# EasyEDA schematic SCH_New-Project_2025-11-07.json

## Sheets
1 Общая схема: TITLE: Abstract schema; REV: 1.0; Date: 2025-10-27; Sheet: 1/1; Drawn By: corlov; Company: Orlov
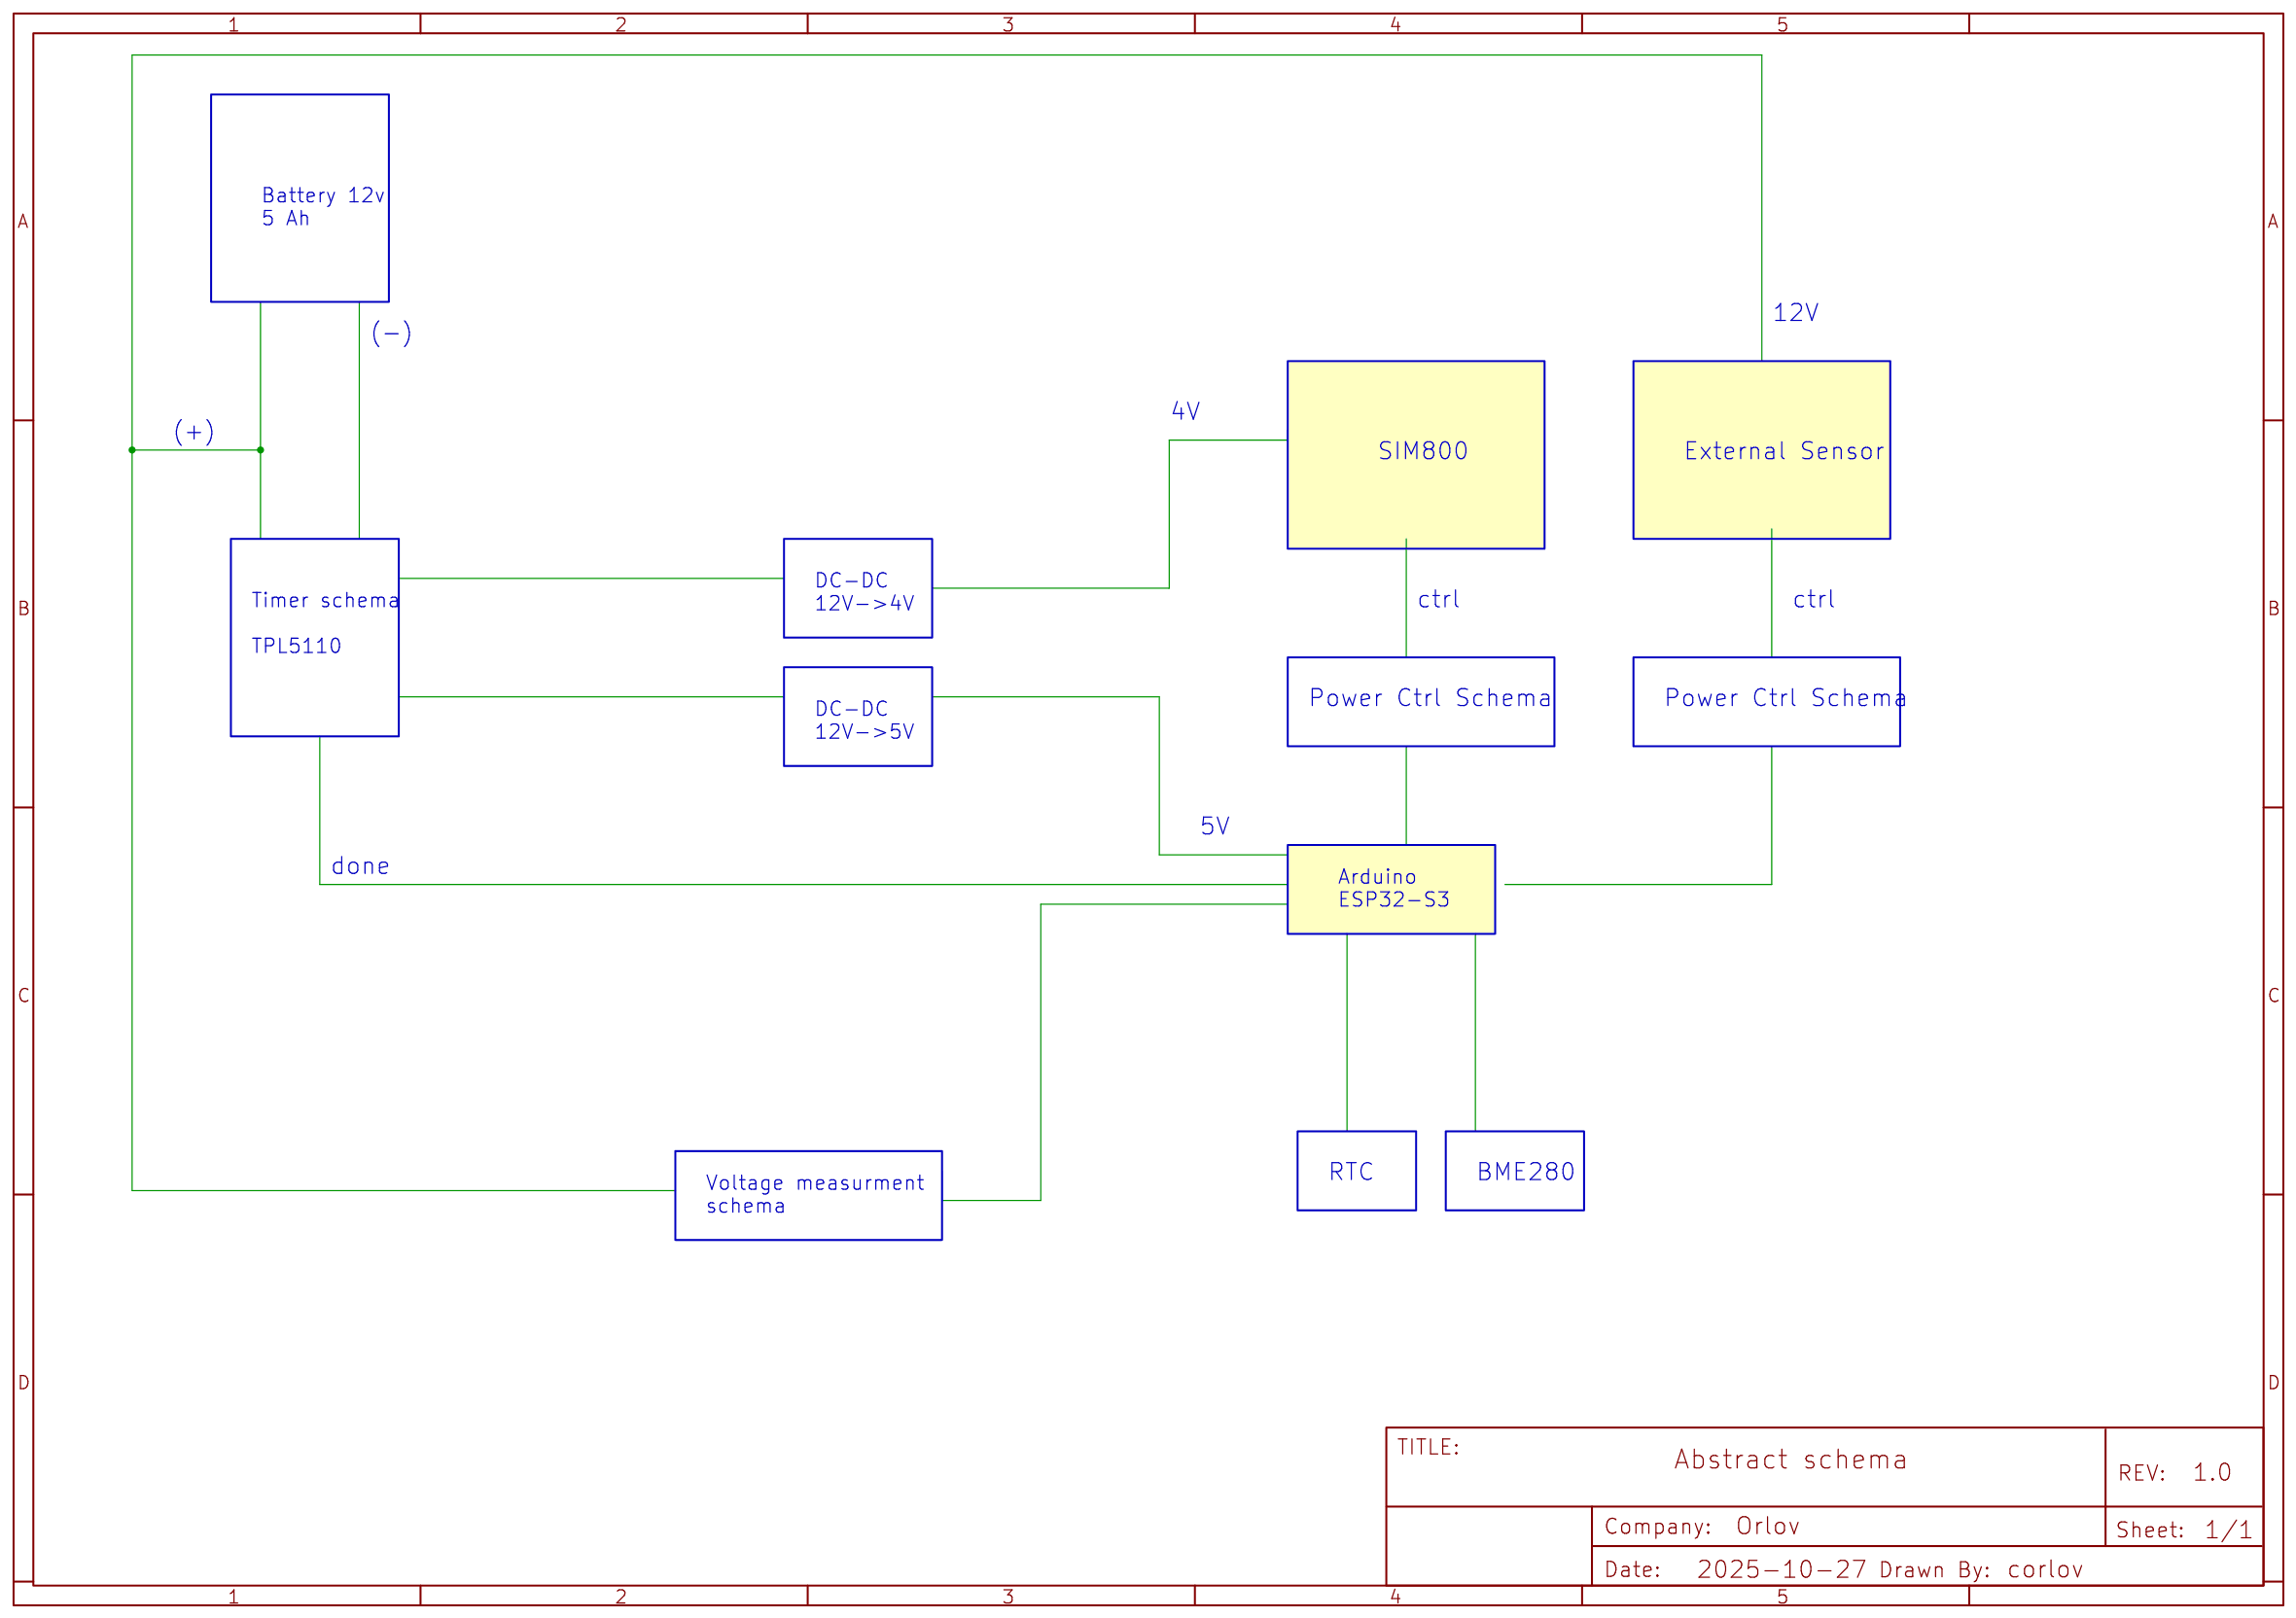
[diagram p0: Общая схема]
2 Питание по таймеру: TITLE: Timer TPL5110
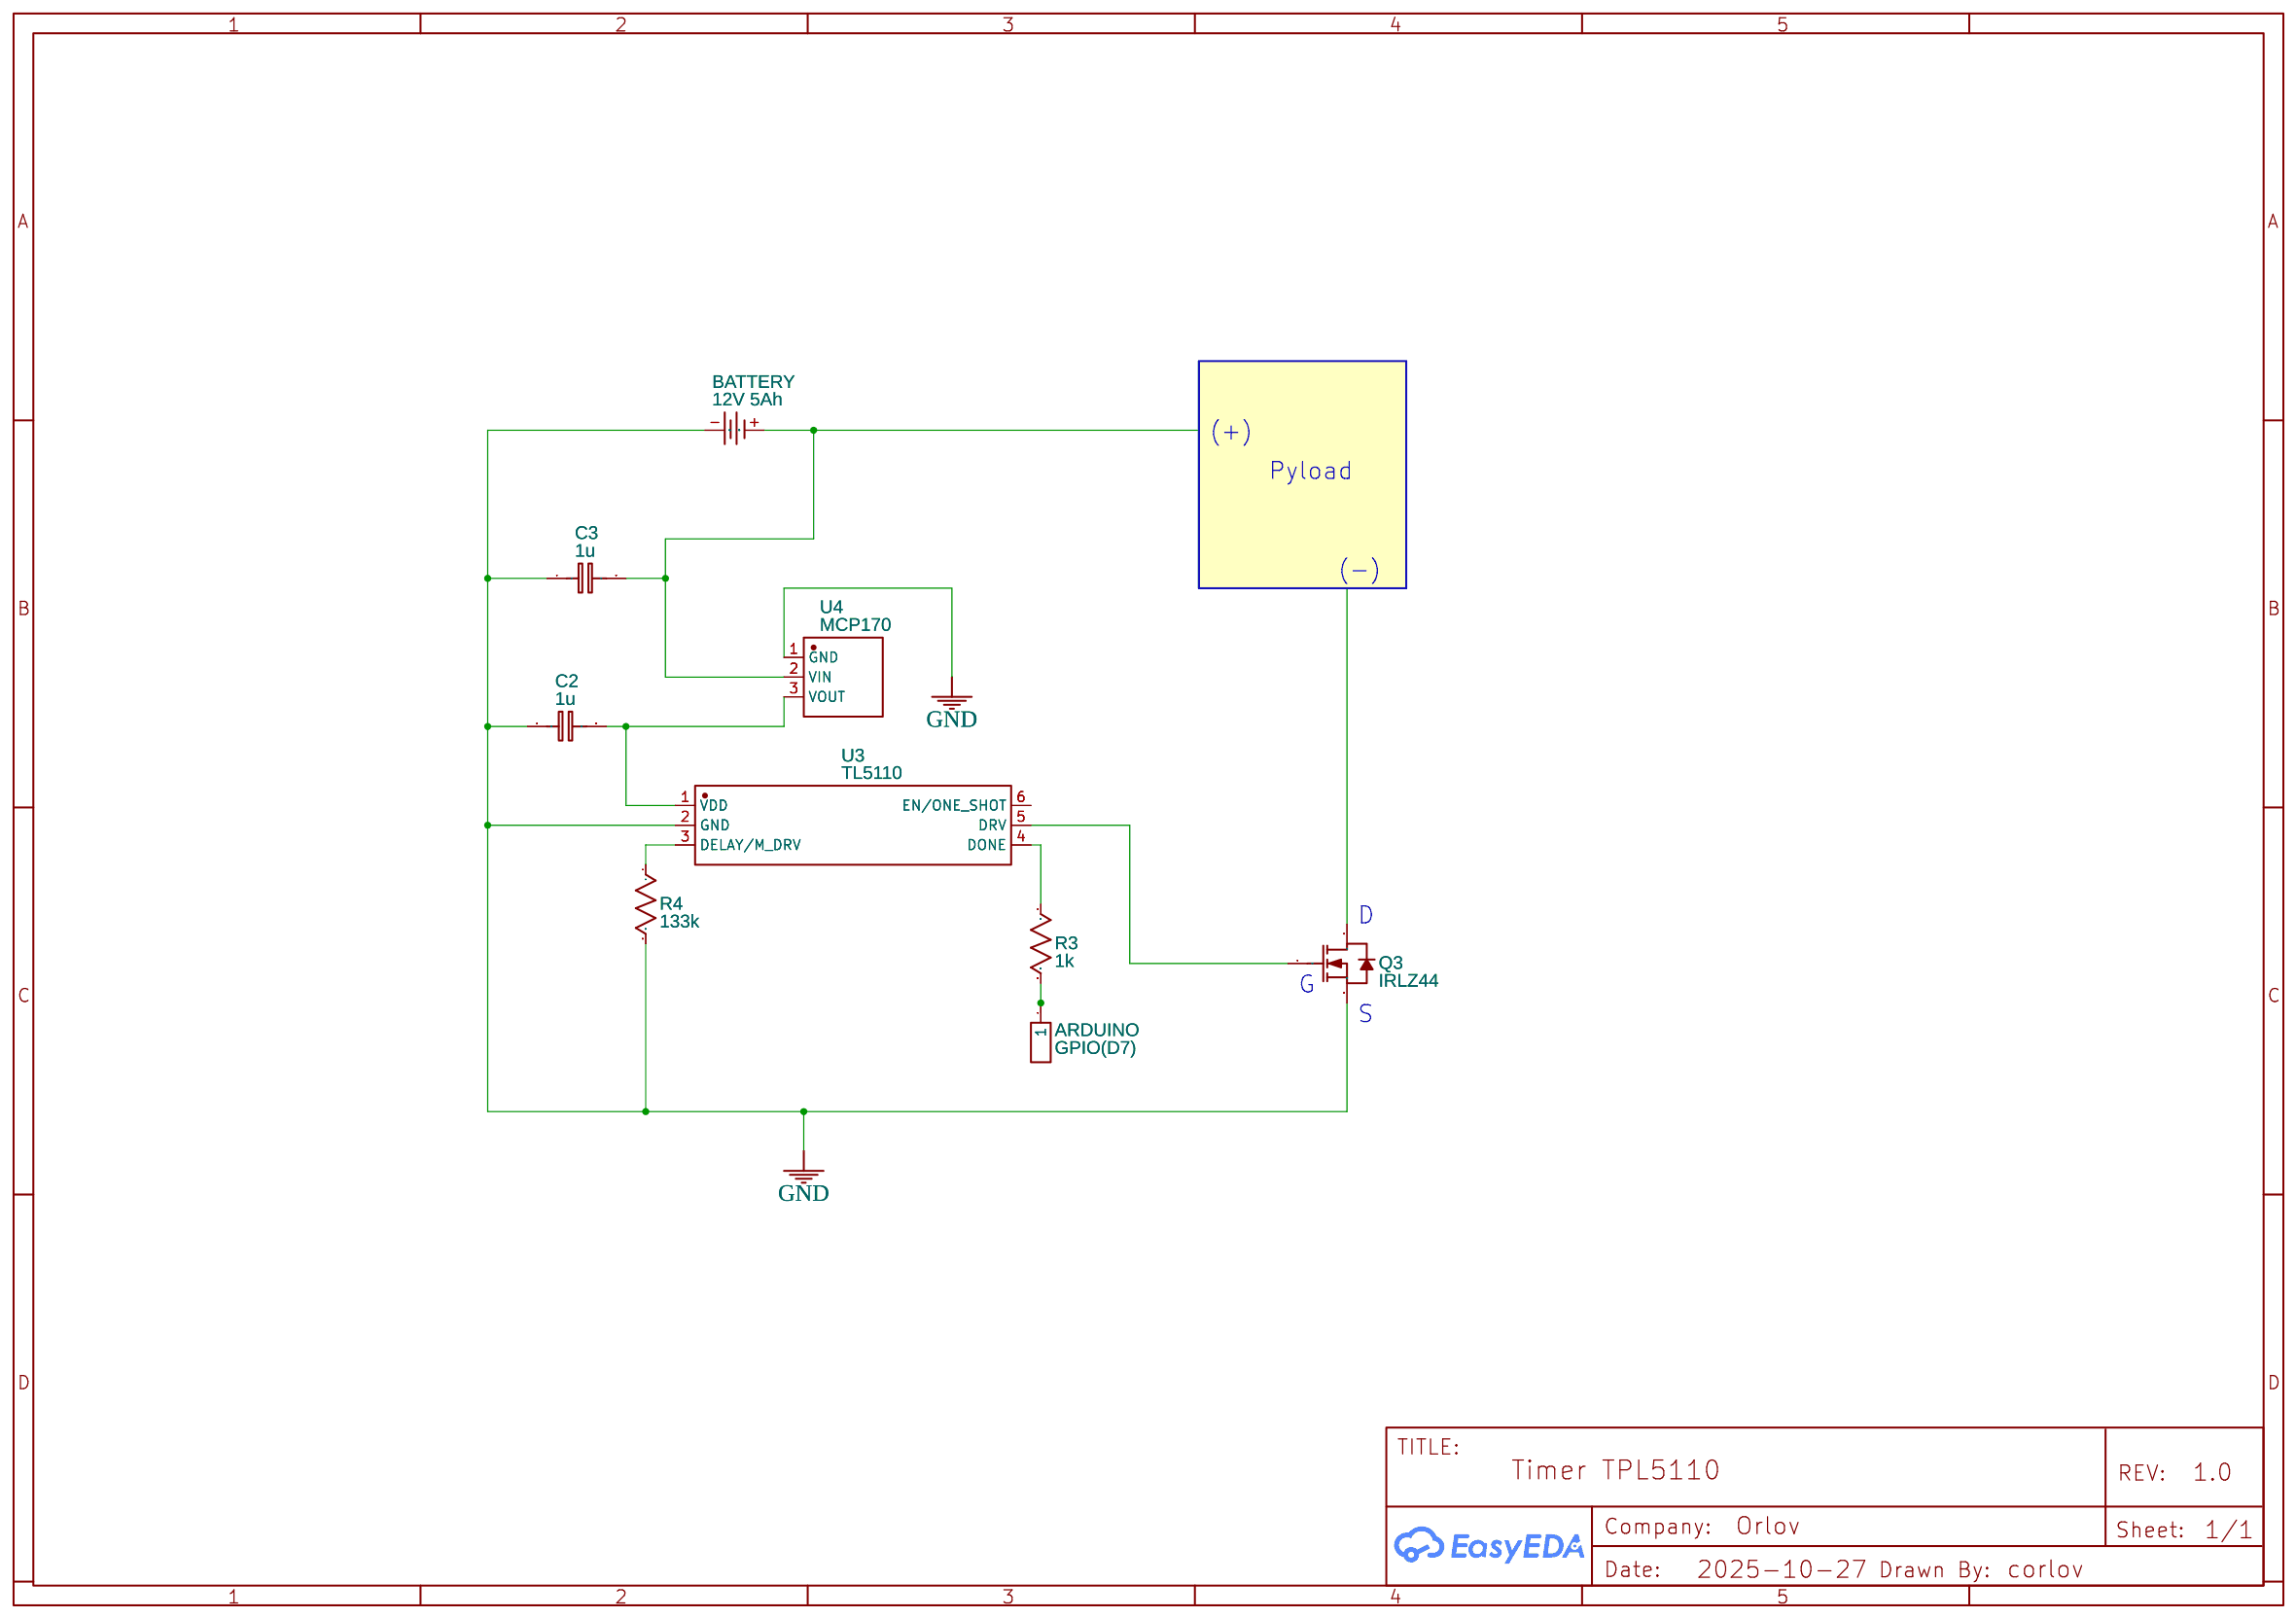
[diagram p1: Питание по таймеру]
3 PowerSwtich: TITLE: Power controol schema (sim/sensor); Date: 2025-10-26
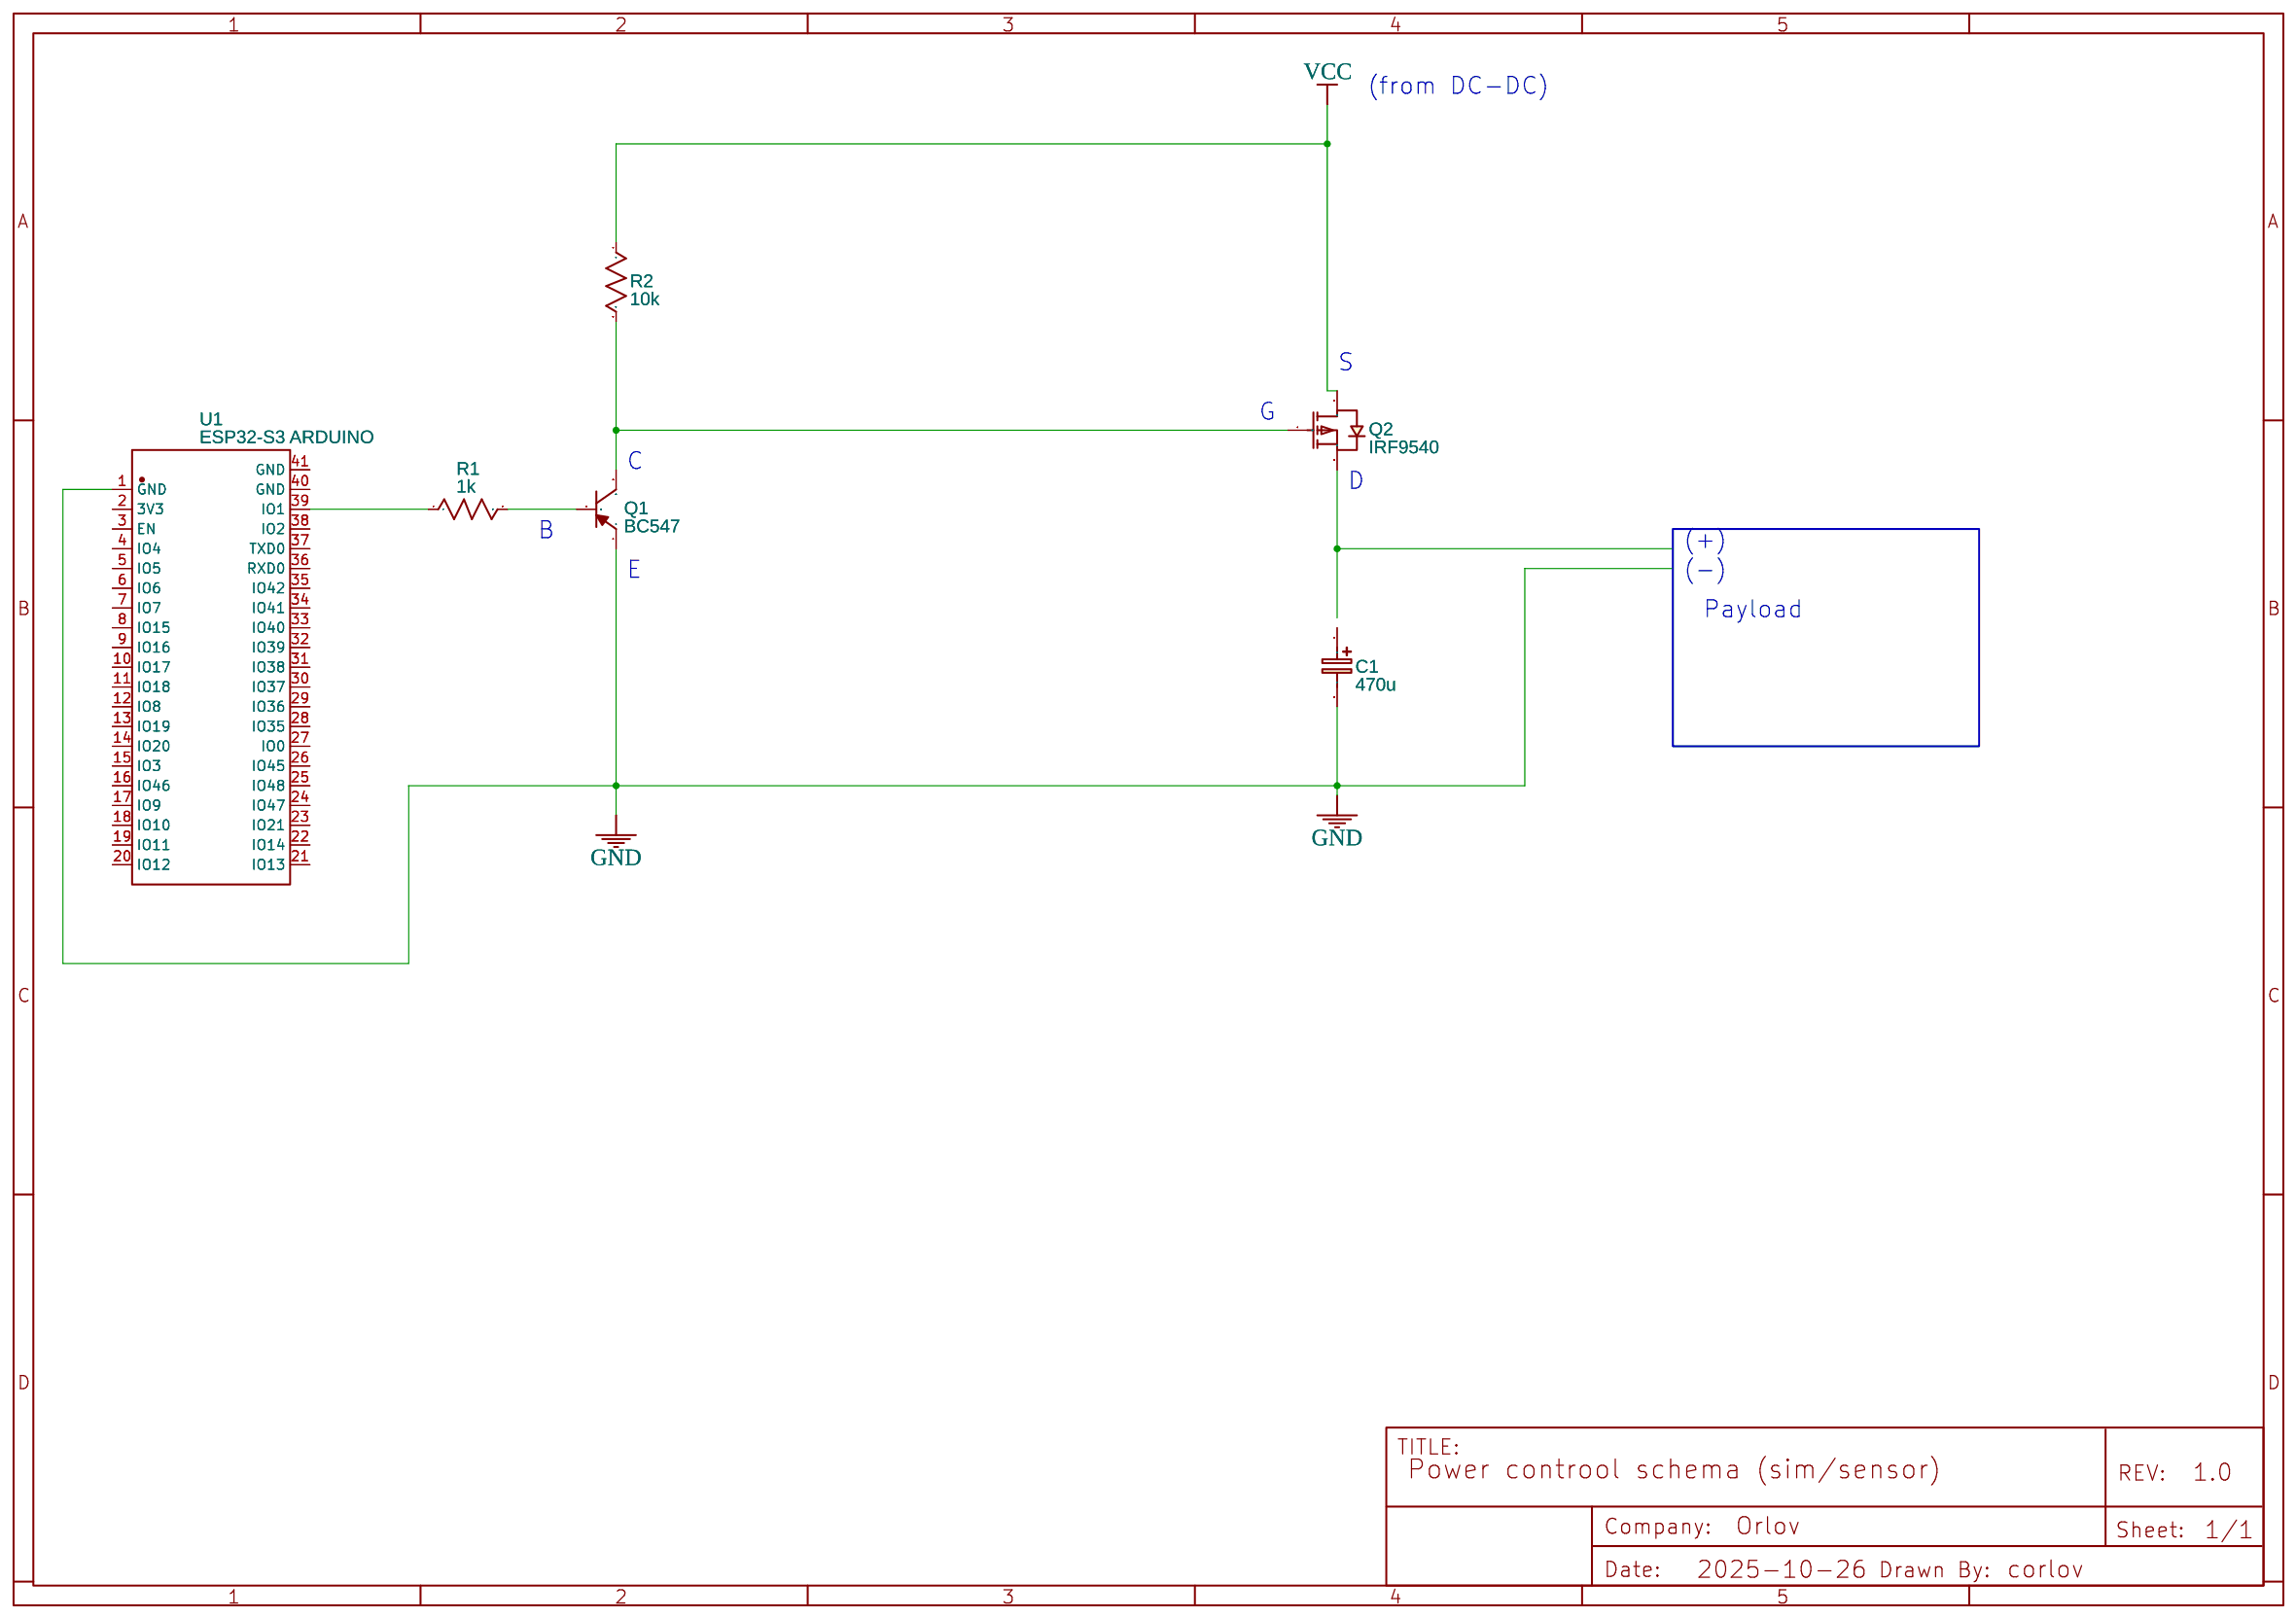
[diagram p2: PowerSwtich]
4 Отключаемый делитель: TITLE: Voltage delimeter (voltage mesurment schema)
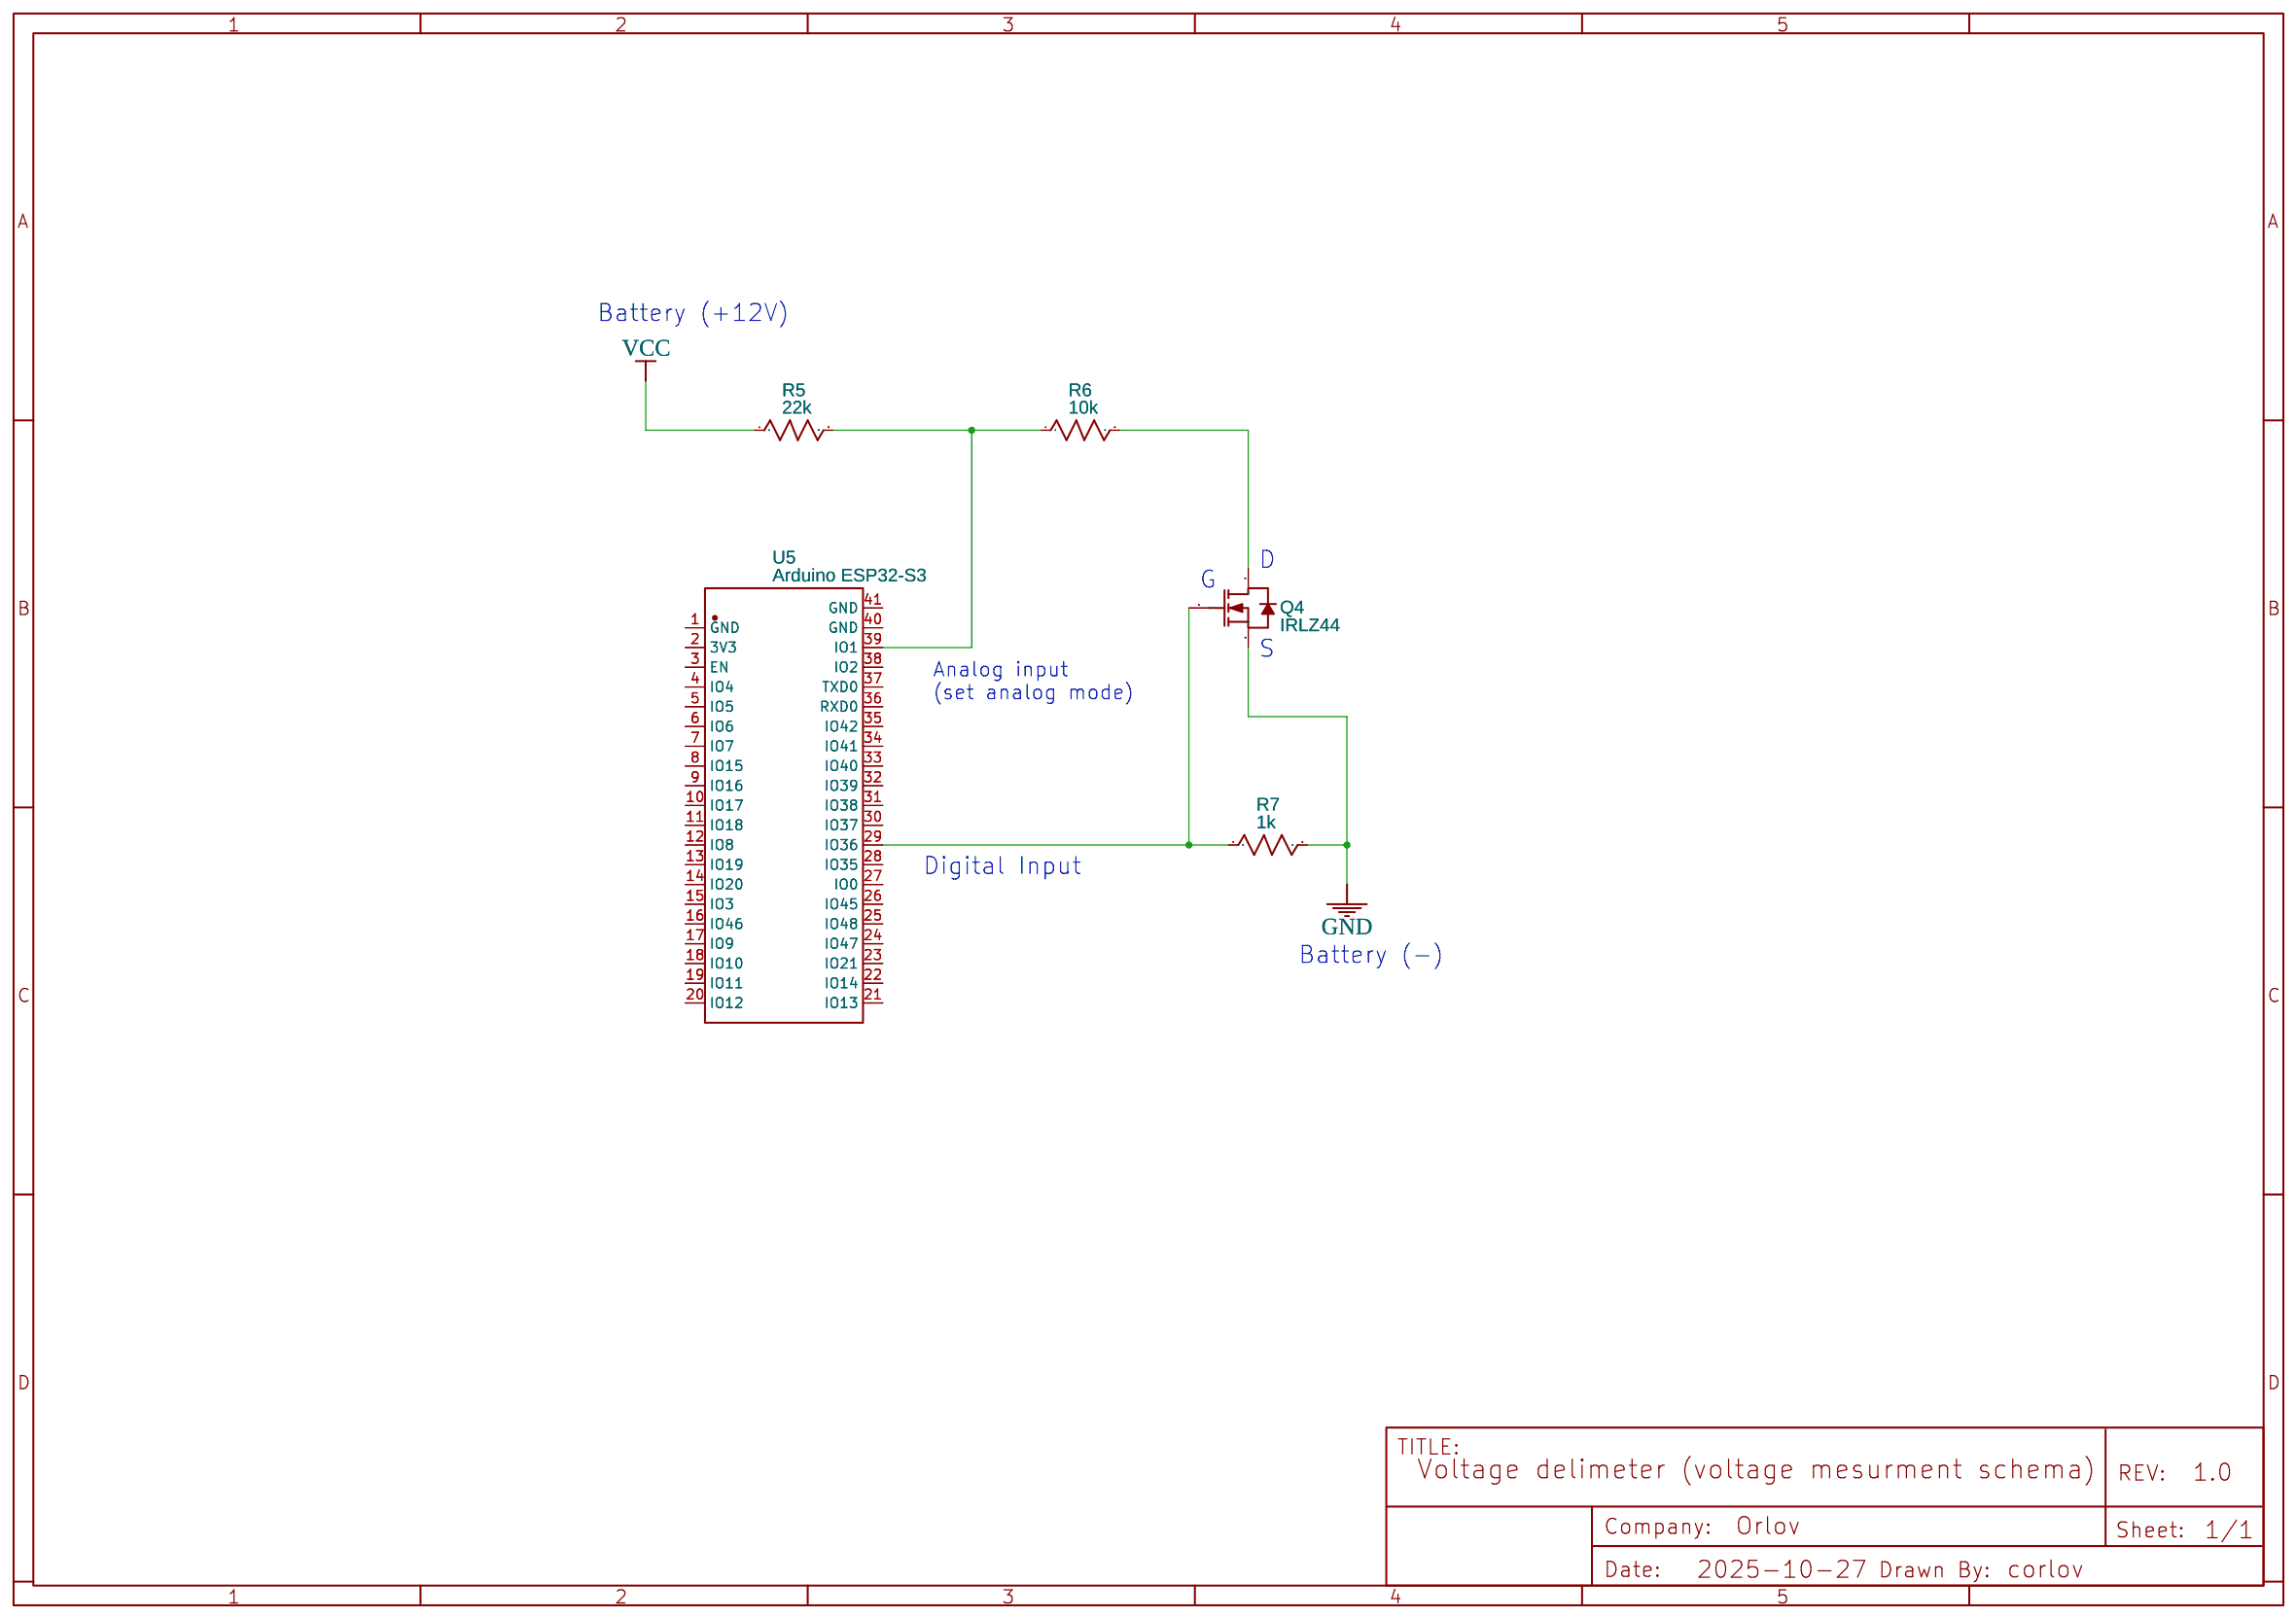
[diagram p3: Отключаемый делитель]
5 Питание по таймеру вар.2: TITLE: Sheet_1; Date: 2025-10-28; Company: Your Company
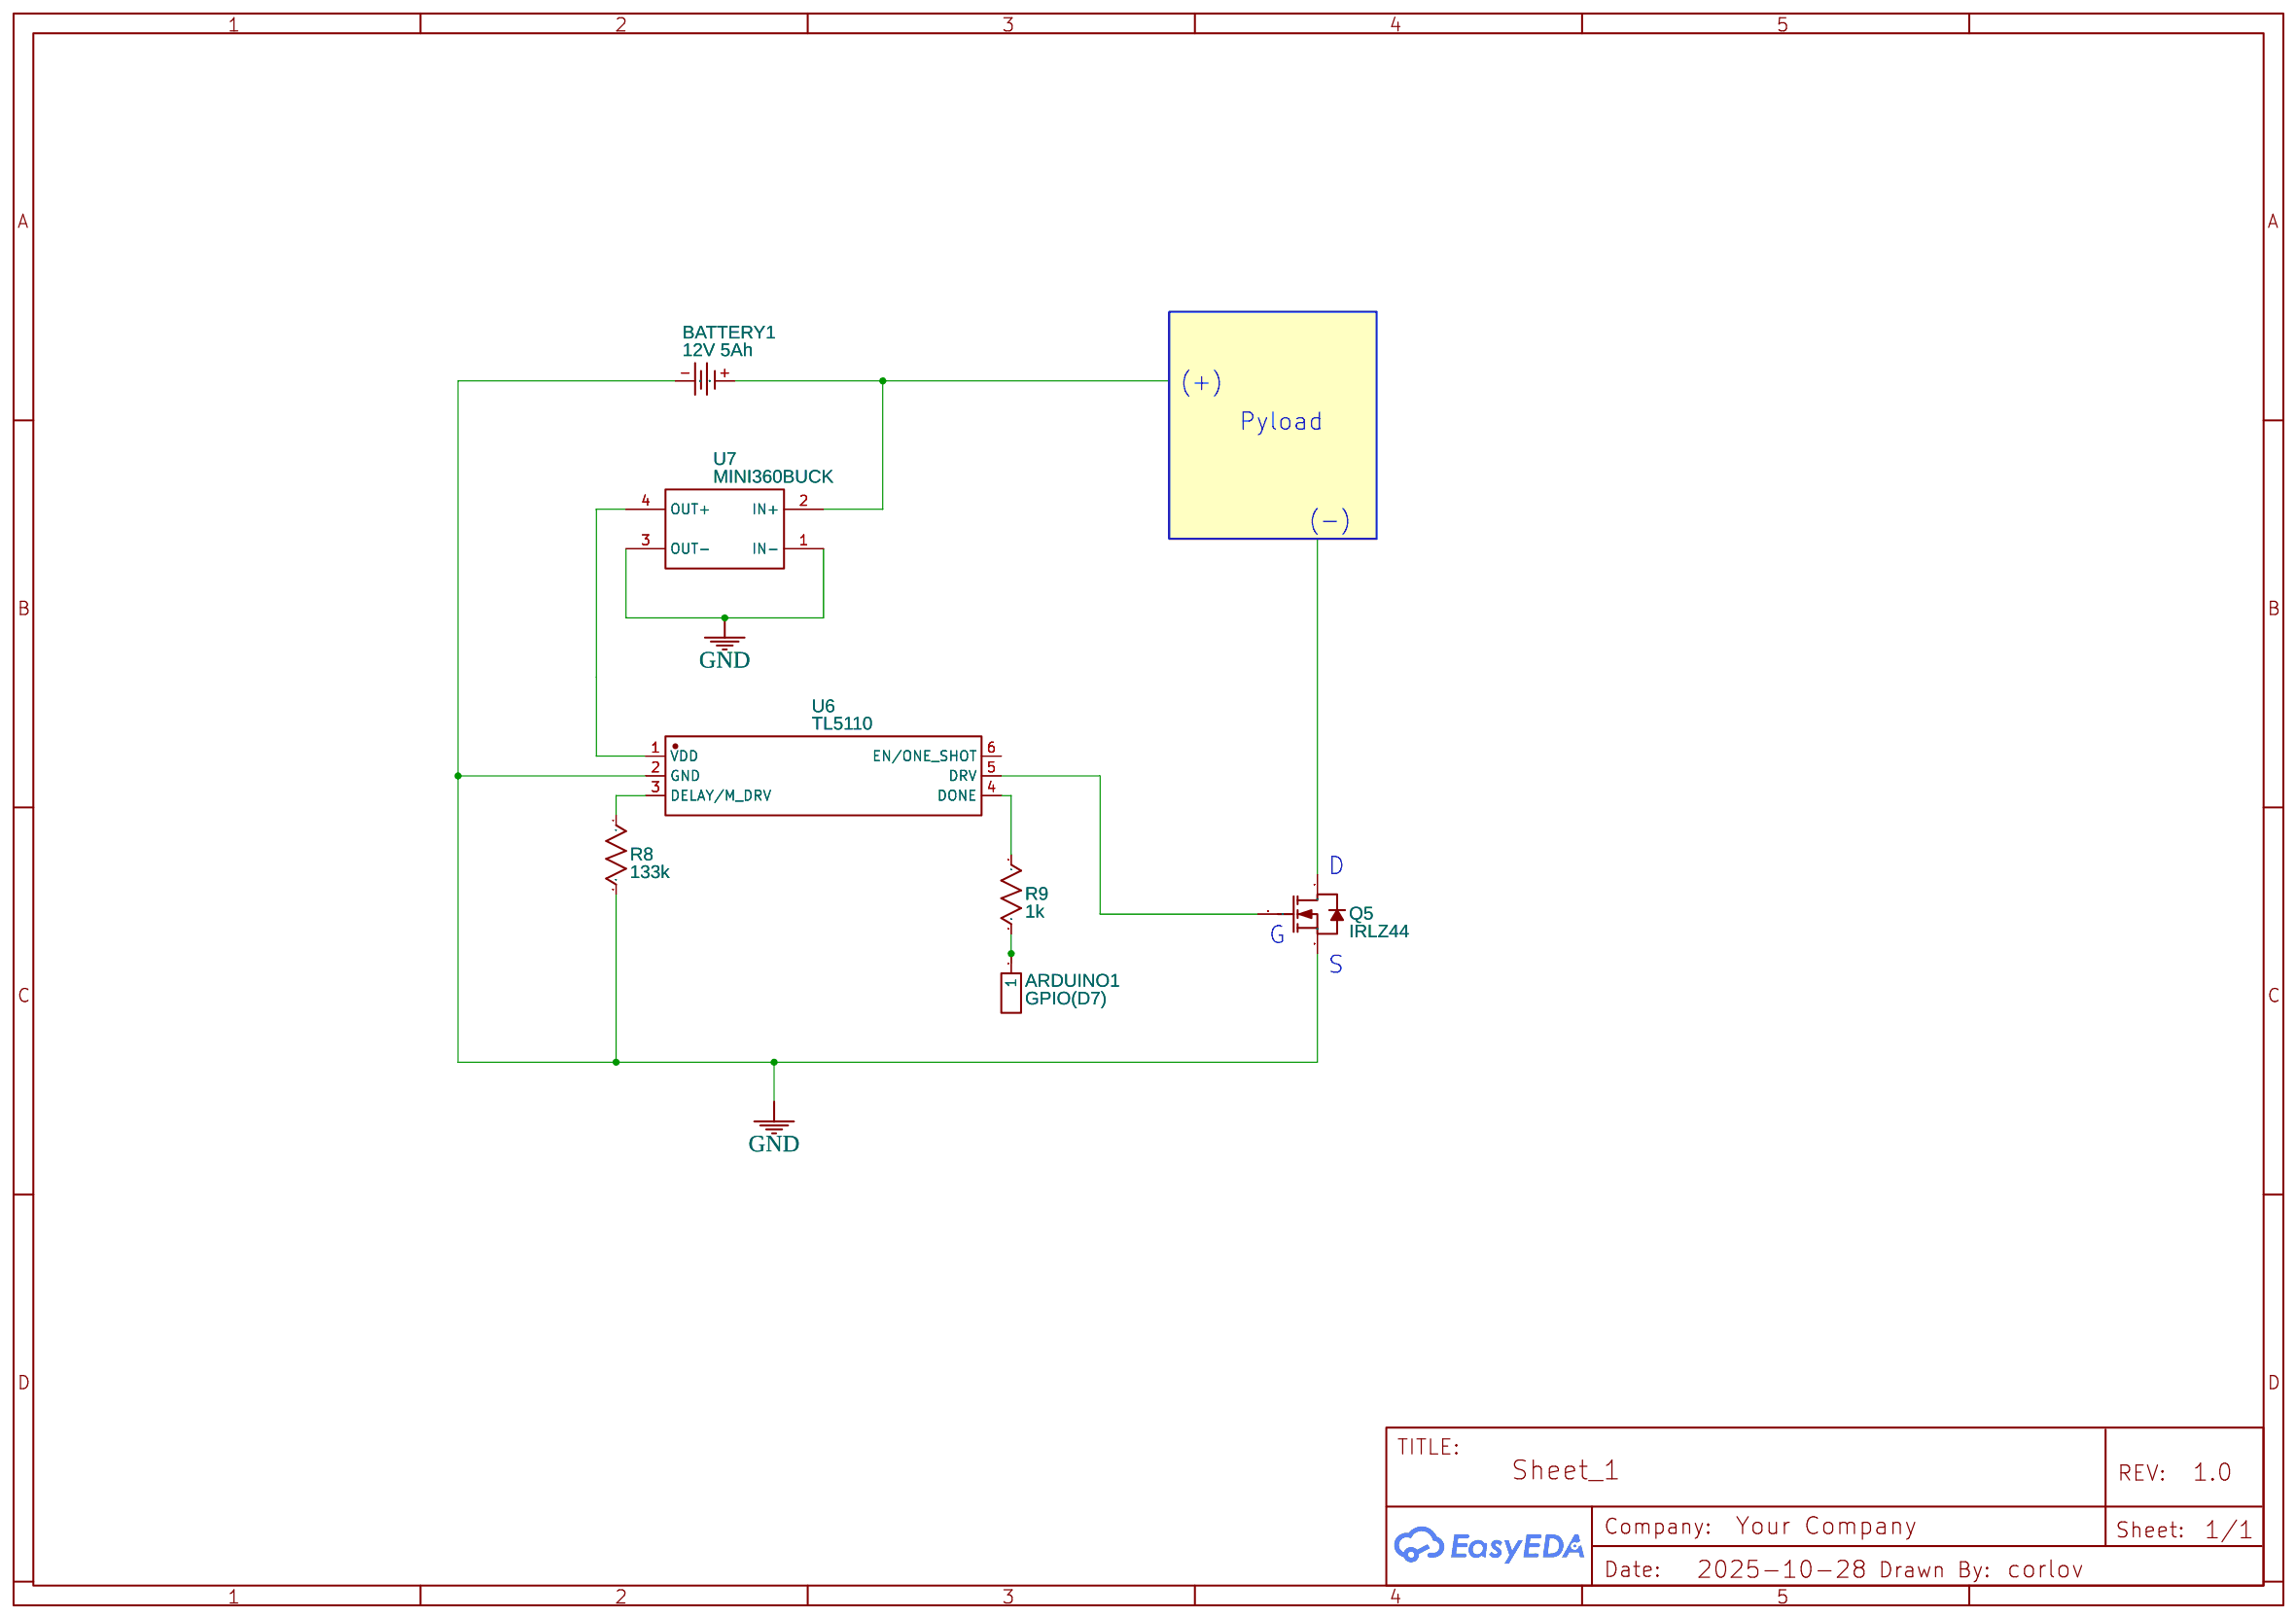
[diagram p4: Питание по таймеру вар.2]
6 Full(1): TITLE: Total with transisors; Date: 2025-10-28; Company: Your Company
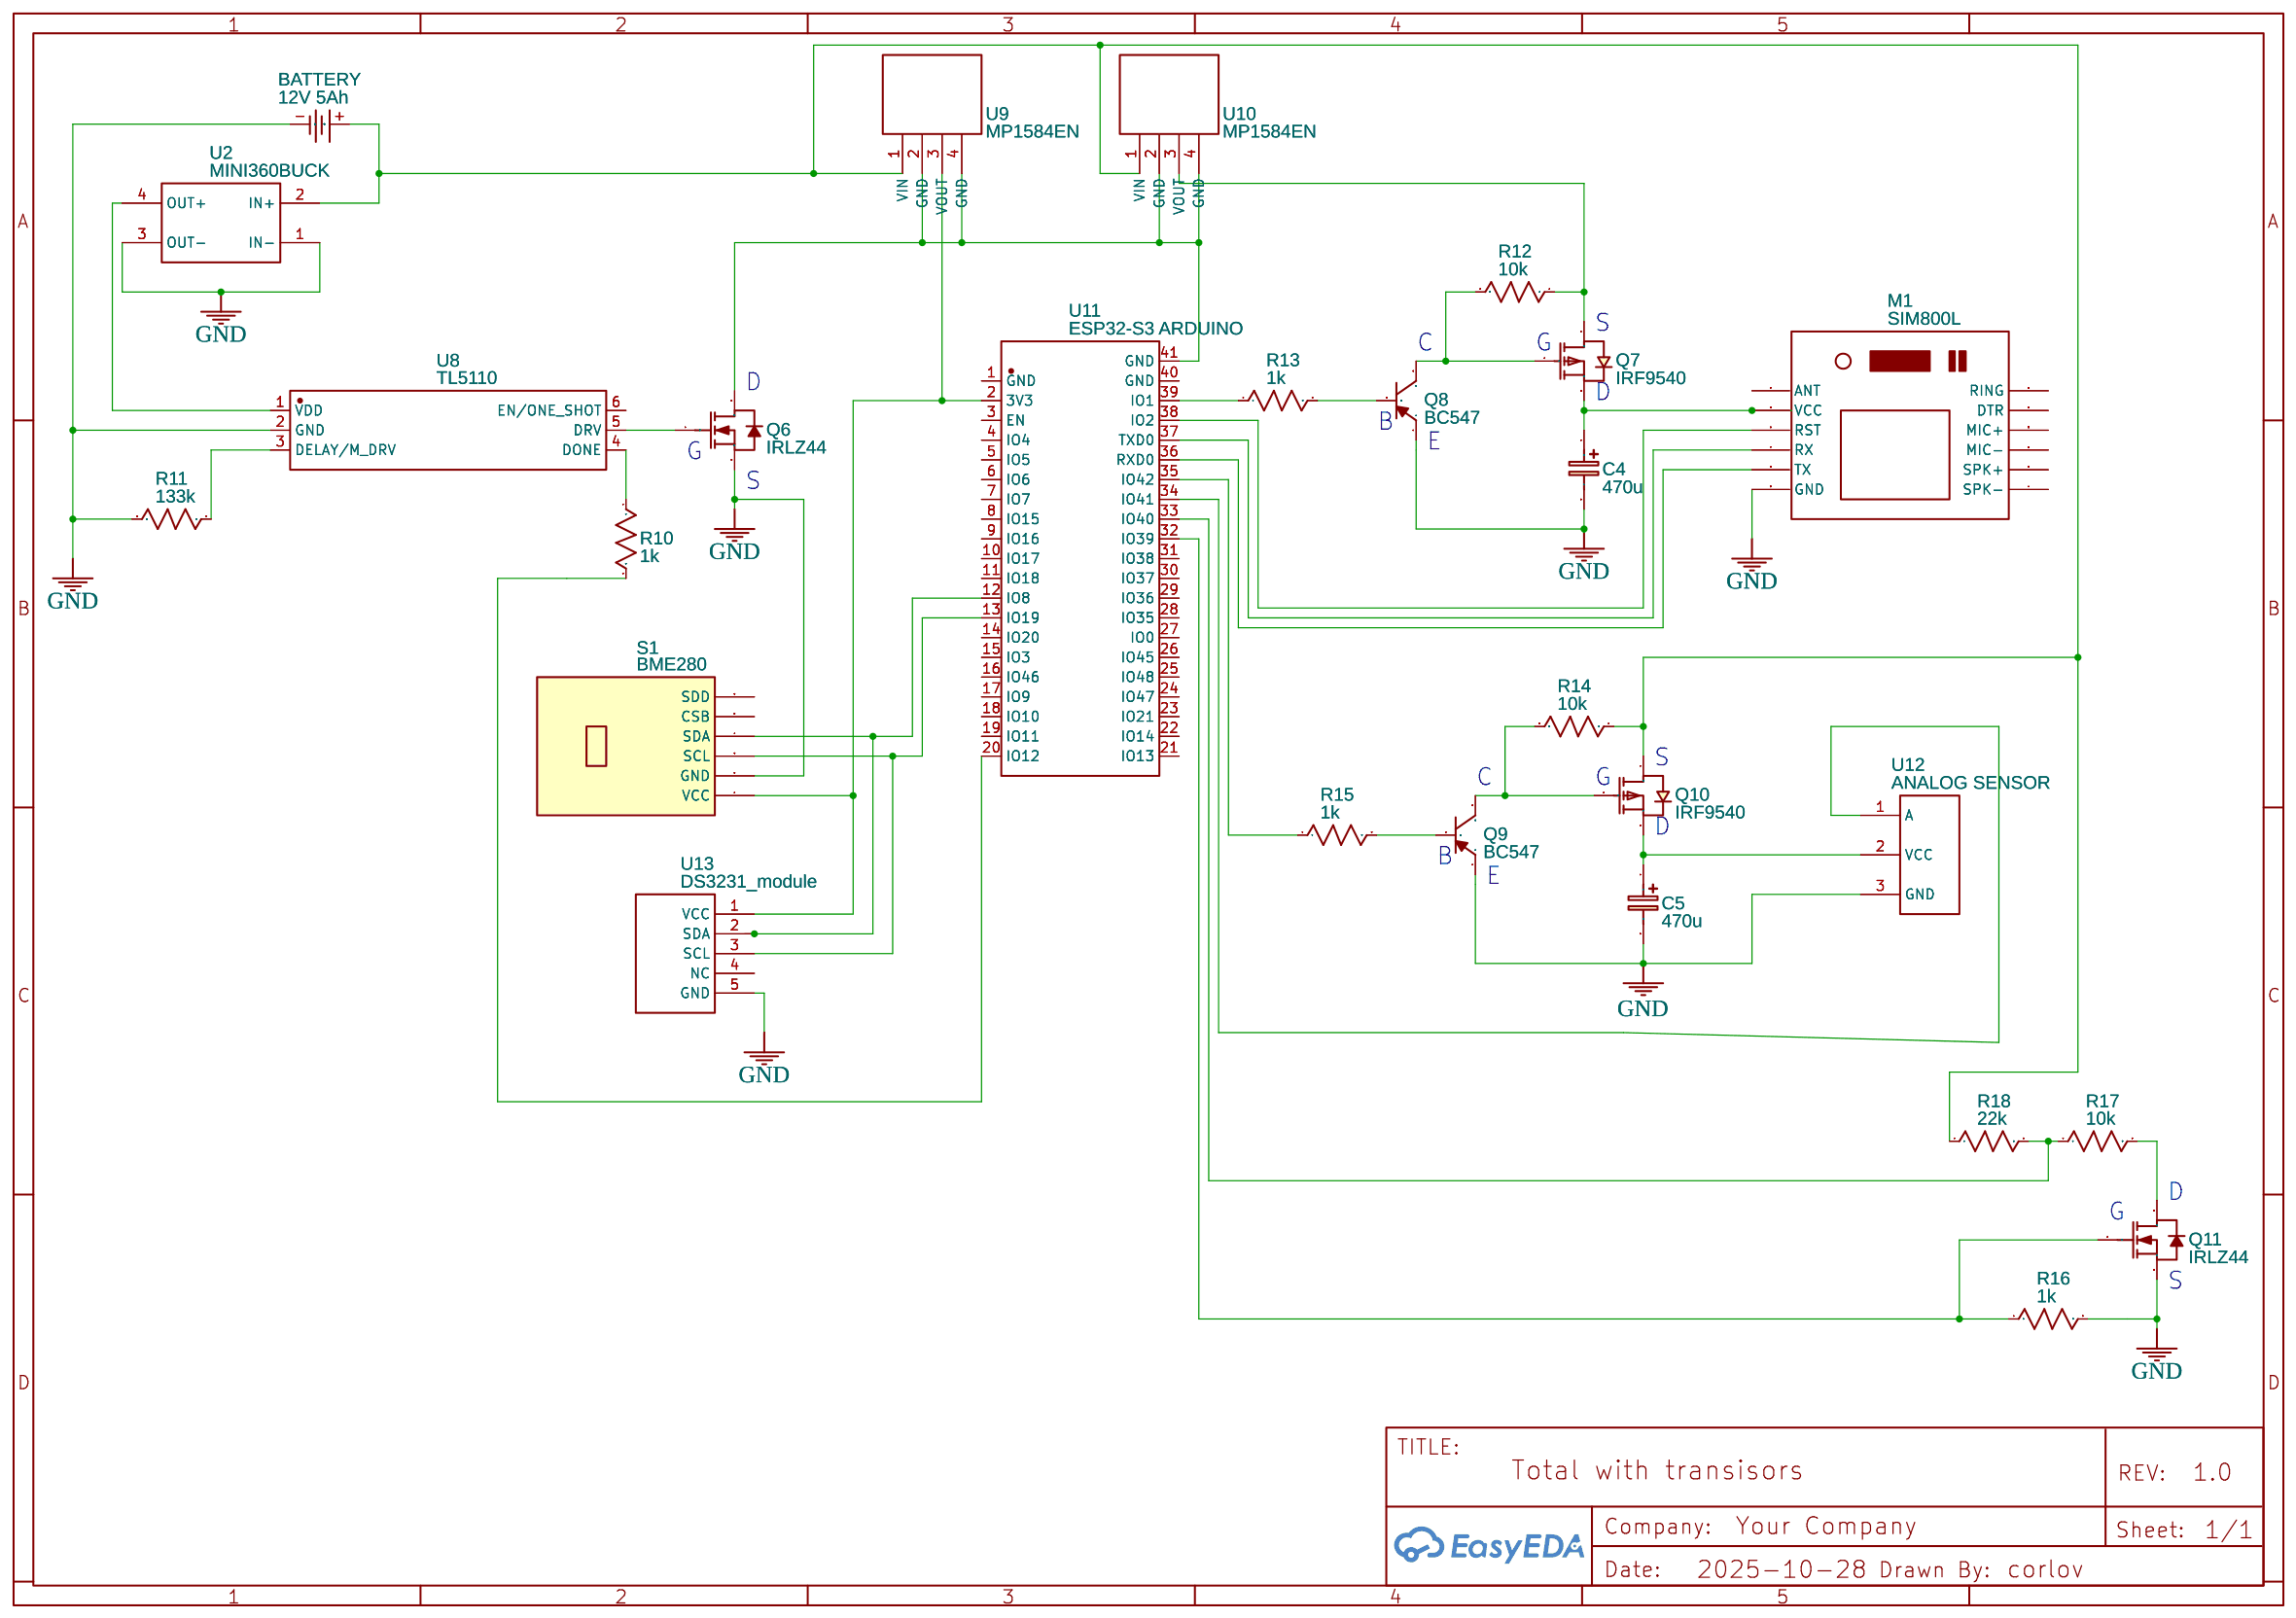
[diagram p5: Full(1)]
7 Full(2): TITLE: Total with MOffset keys (more simple for manufacture); Date: 2025-10-29; Company: Your Company
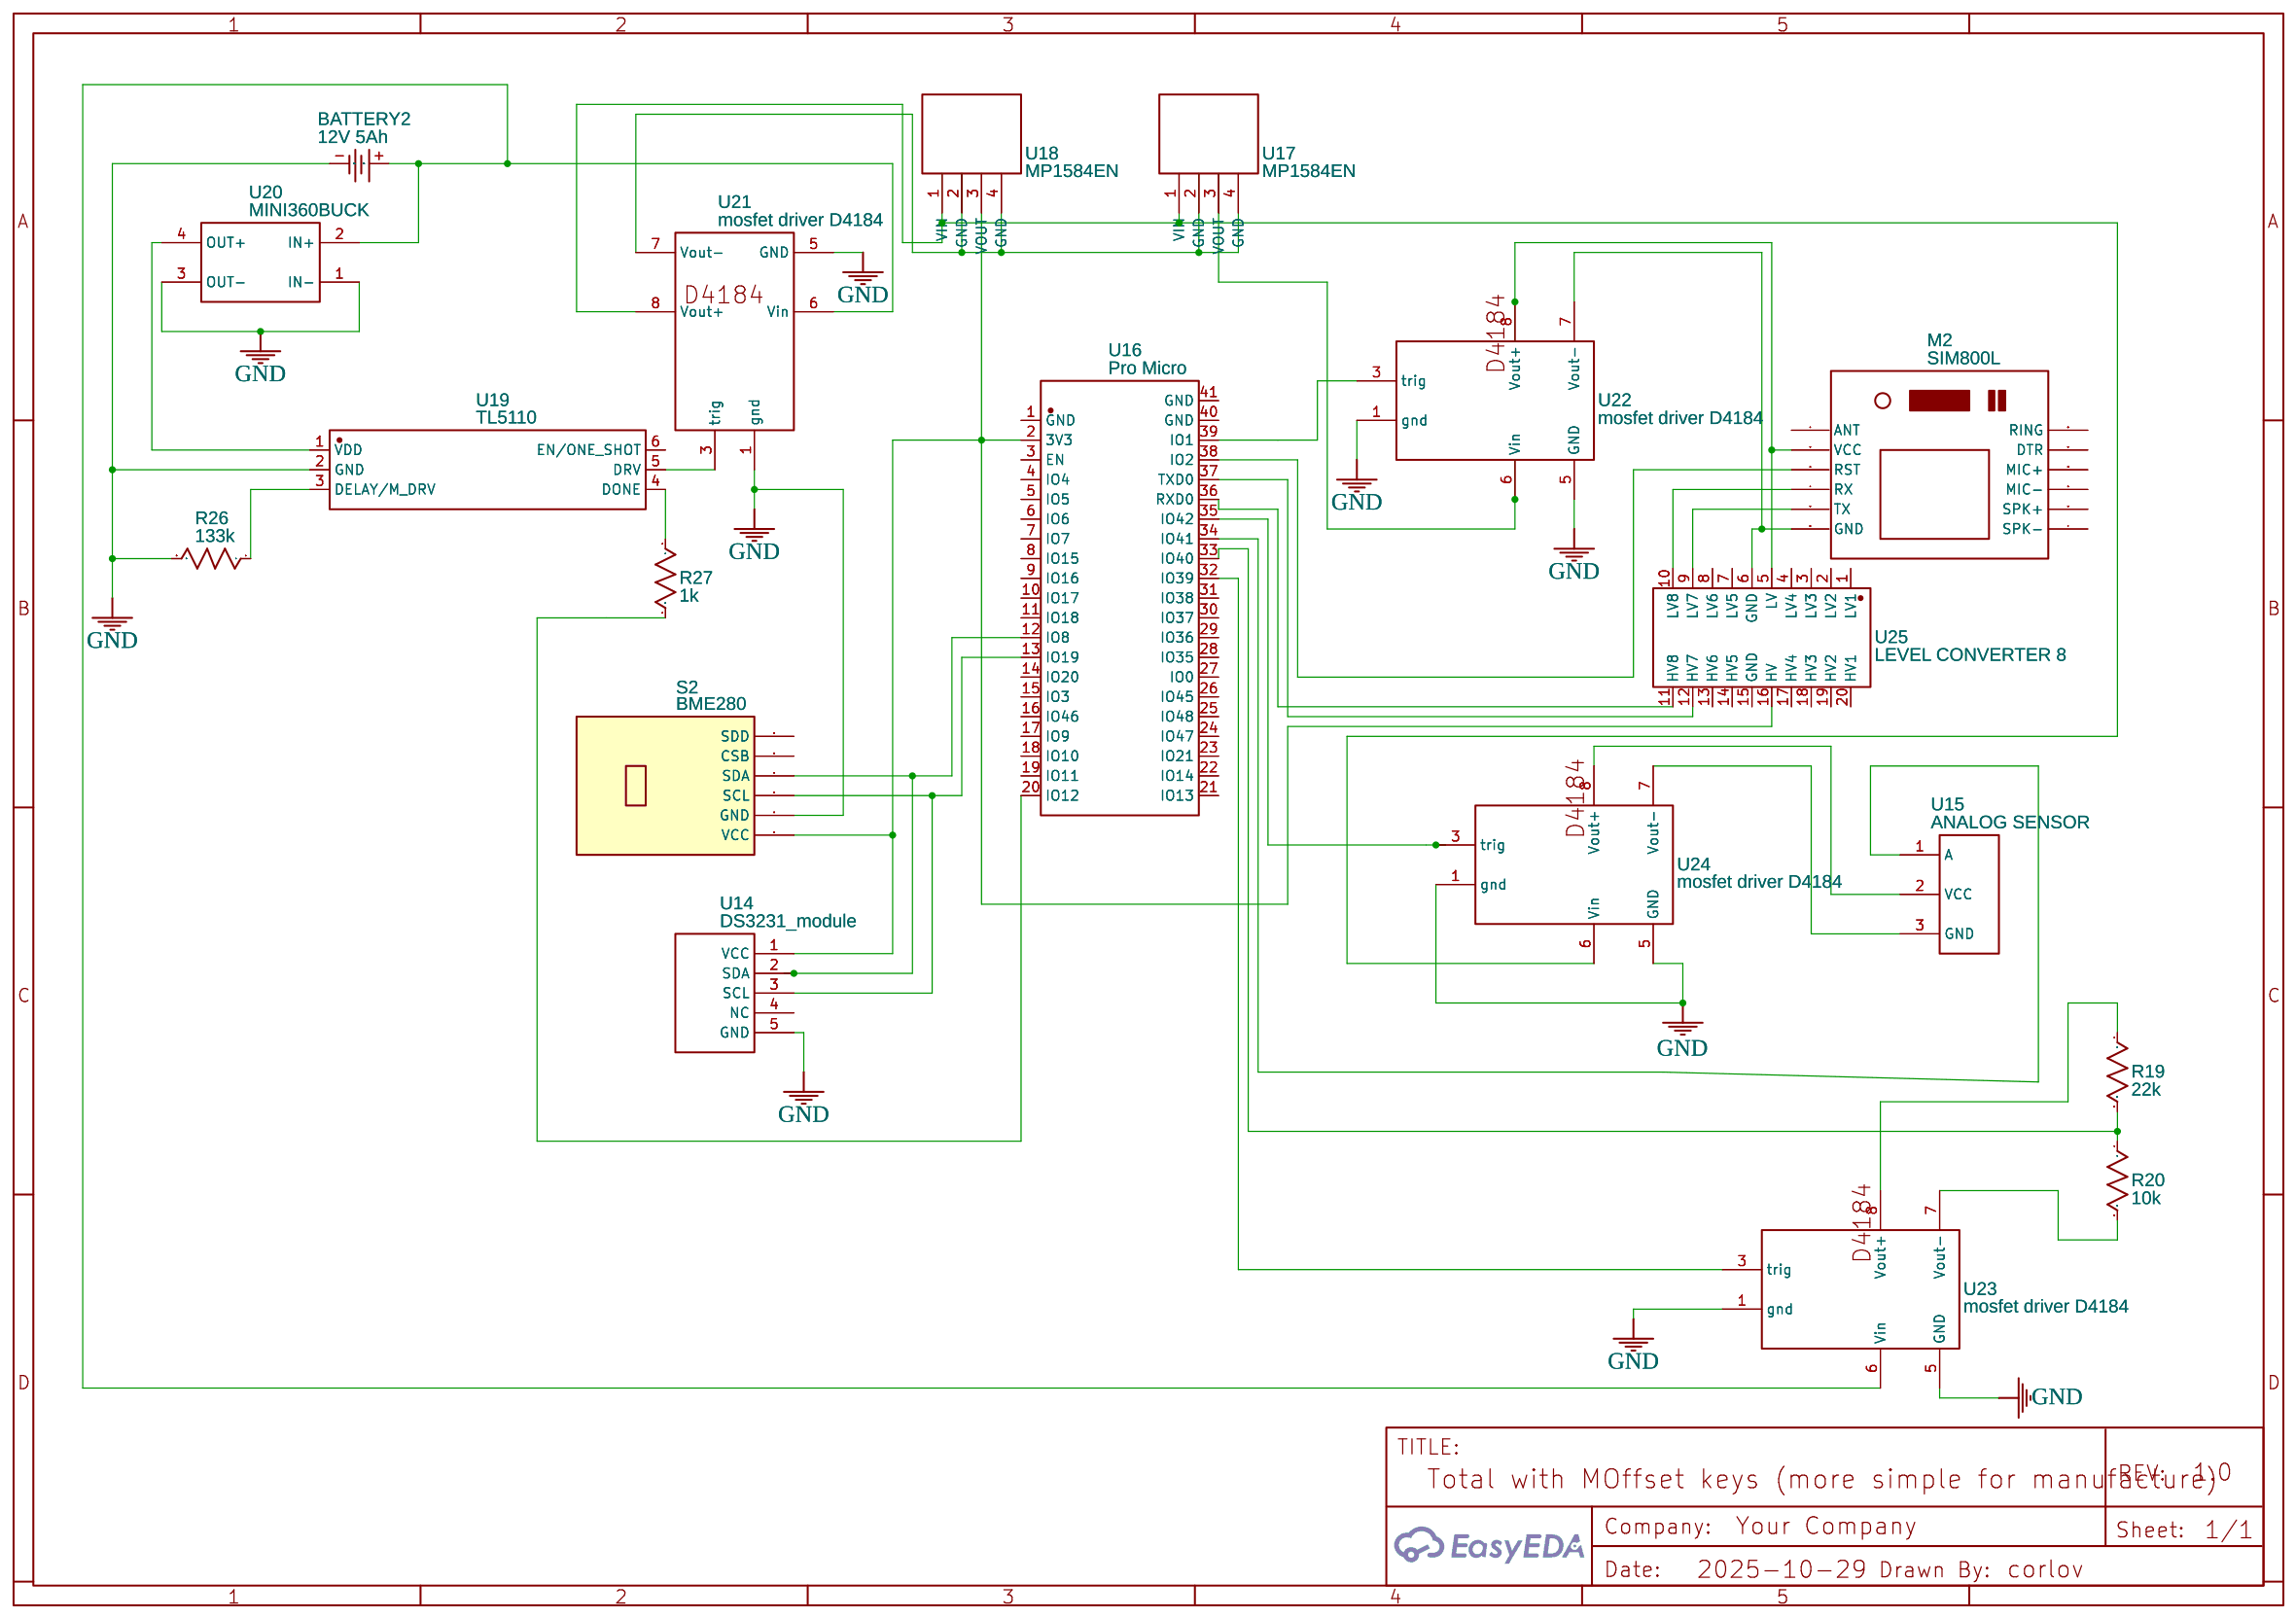
[diagram p6: Full(2)]
8 Sheet_1: TITLE: Total (high side switch) ESP32; Date: 2025-10-28; Company: Your Company
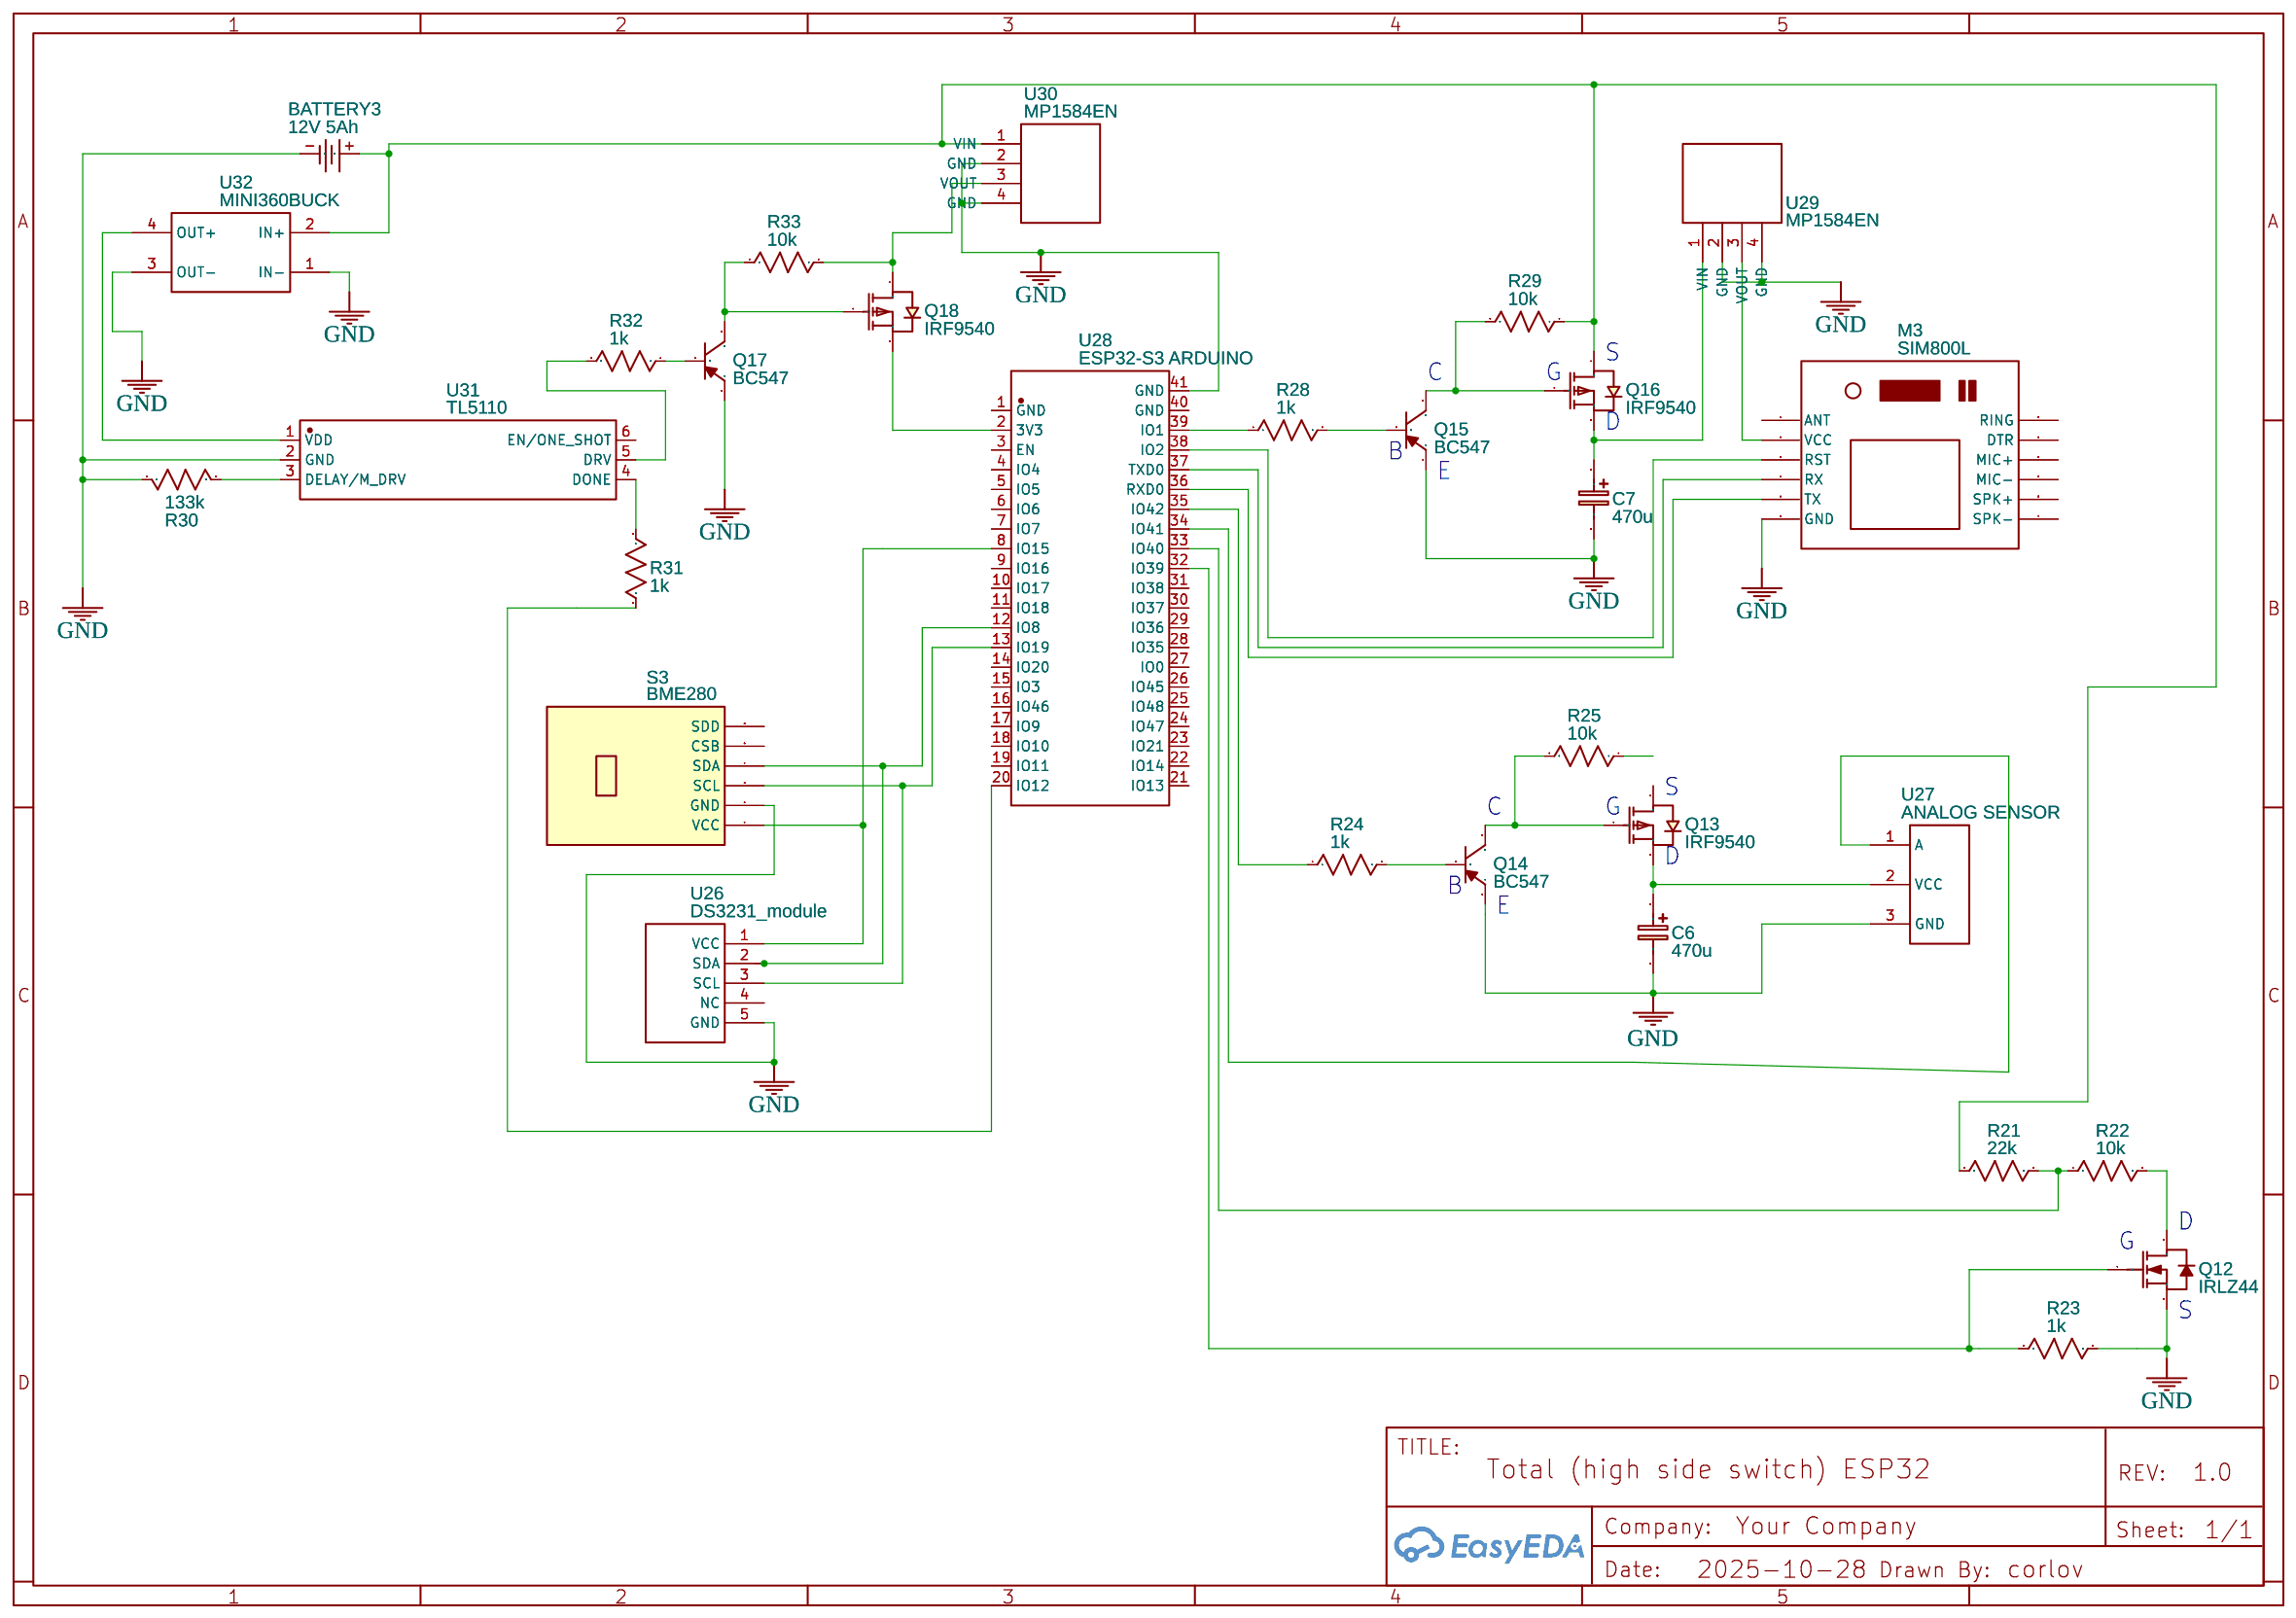
[diagram p7: Sheet_1]
9 Sheet_2: TITLE: Total (high side switch) ProMicro; Date: 2025-10-28; Company: Your Company
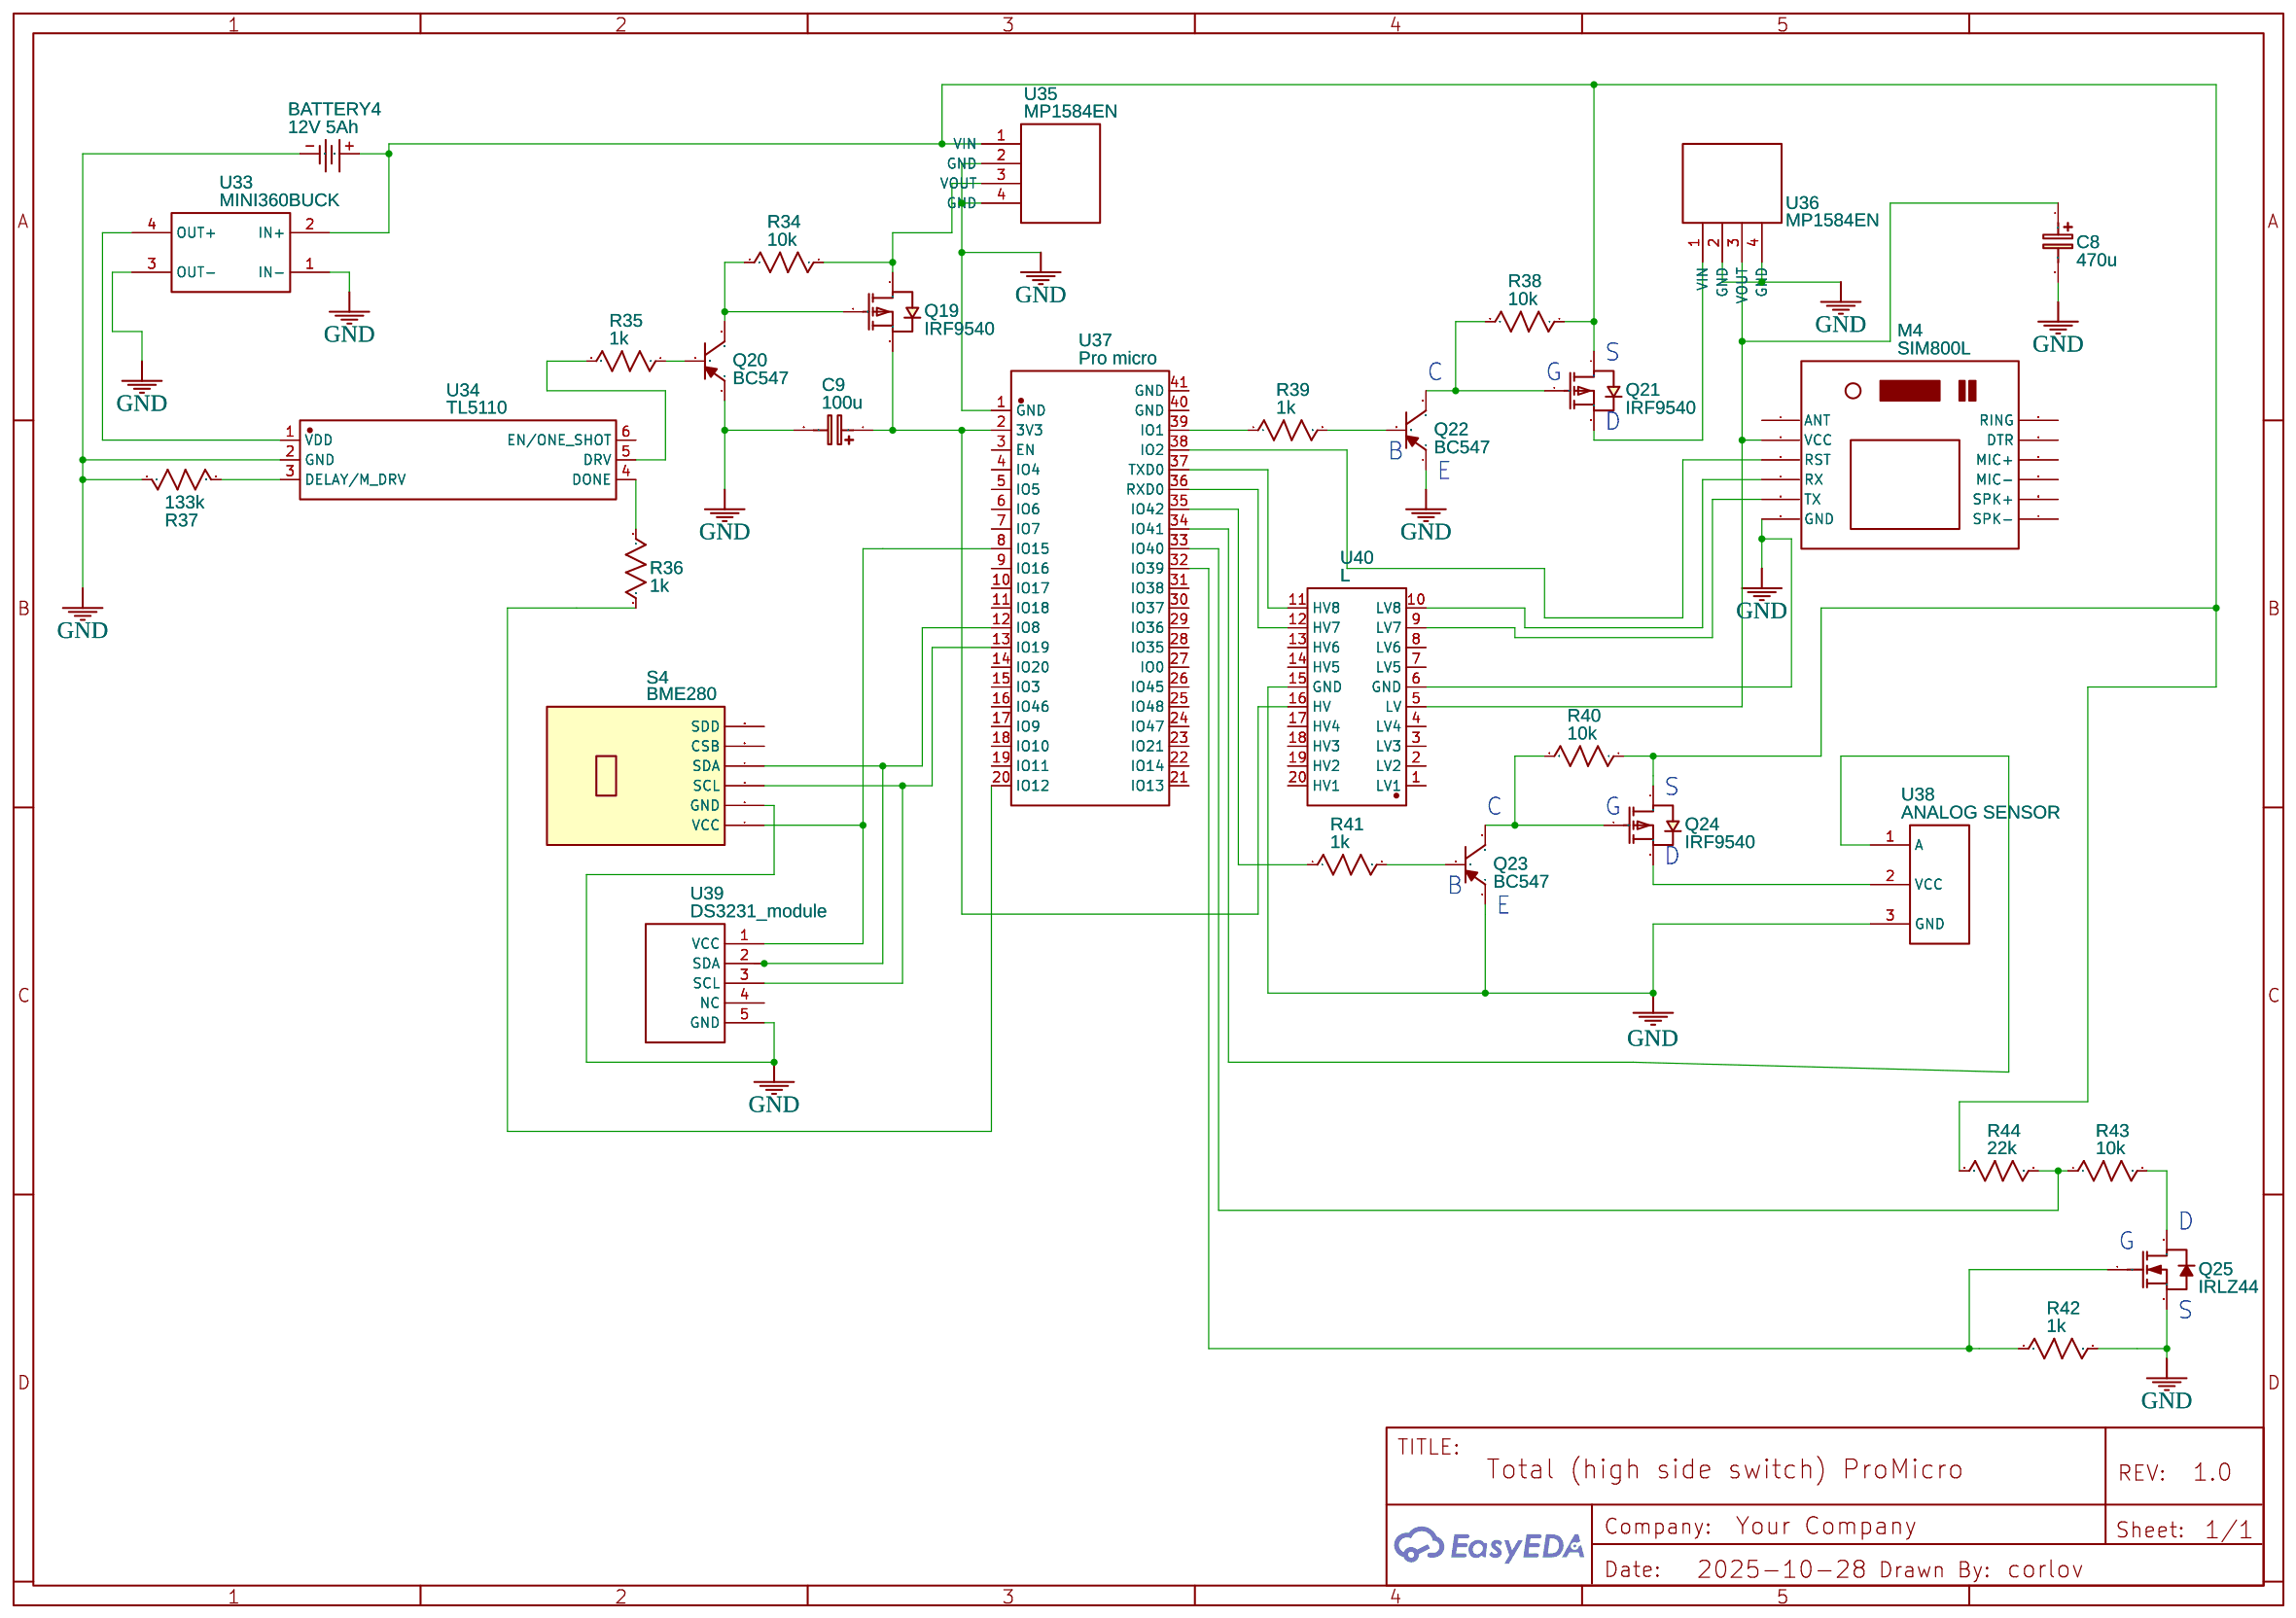
[diagram p8: Sheet_2]

## Parts
sheet Full(1)
BATTERY#2  12V 5Ah  [BATTERY-SMD-MY-2032]
C4  470u  [CASE-A_3216]
C5  470u  [CASE-A_3216]
M1  SIM800L  [SIM800LMODULE_SIM800LMODULE]
Q6  IRLZ44  [TO-220-3_L10.0-W4.5-P2.54-T]
Q7  IRF9540  [TO-263-2_L10.0-W9.1-P5.08-LS15.2-BR]
Q8  BC547  [SOT-23-3_L2.9-W1.6-P1.90-LS2.8-TR-CW]
Q9  BC547  [SOT-23-3_L2.9-W1.6-P1.90-LS2.8-TR-CW]
Q10  IRF9540  [TO-263-2_L10.0-W9.1-P5.08-LS15.2-BR]
Q11  IRLZ44  [TO-220-3_L10.0-W4.5-P2.54-T]
R10  1k  [R0603]
R11  133k  [R0603]
R12  10k  [R0603]
R13  1k  [R0603]
R14  10k  [R0603]
R15  1k  [R0603]
R16  1k  [R0603]
R17  10k  [R0603]
R18  22k  [R0603]
S1  BME280  [BME280]
U2  MINI360BUCK  [MINI360BUCK]
U8  TL5110  [TSOT-23-6_L2.9-W1.6-P0.95-LS2.8-BR]
U9  MP1584EN  [MP1584EN]
U10  MP1584EN  [MP1584EN]
U11  ESP32-S3 ARDUINO  [WIRELM-SMD_ESP32-S3-WROOM-1U]
U12  ANALOG SENSOR  [ANALOG SENSOR V1]
U13  DS3231_module  [DS3231]
sheet Full(2)
BATTERY2  12V 5Ah  [BATTERY-SMD-MY-2032]
M2  SIM800L  [SIM800LMODULE_SIM800LMODULE]
R19  22k  [R0603]
R20  10k  [R0603]
R26  133k  [R0603]
R27  1k  [R0603]
S2  BME280  [BME280]
U14  DS3231_module  [DS3231]
U15  ANALOG SENSOR  [ANALOG SENSOR V1]
U16  Pro Micro  [WIRELM-SMD_ESP32-S3-WROOM-1U]
U17  MP1584EN  [MP1584EN]
U18  MP1584EN  [MP1584EN]
U19  TL5110  [TSOT-23-6_L2.9-W1.6-P0.95-LS2.8-BR]
U20  MINI360BUCK  [MINI360BUCK]
U21  mosfet driver D4184  [D4184]
U22  mosfet driver D4184  [D4184]
U23  mosfet driver D4184  [D4184]
U24  mosfet driver D4184  [D4184]
U25  LEVEL CONVERTER 8  [MPN-TH-20_L28.0-W14.0-P2.54-BL]
sheet PowerSwtich
C1  470u  [CASE-A_3216]
Q1  BC547  [SOT-23-3_L2.9-W1.6-P1.90-LS2.8-TR-CW]
Q2  IRF9540  [TO-263-2_L10.0-W9.1-P5.08-LS15.2-BR]
R1  1k  [R0603]
R2  10k  [R0603]
U1  ESP32-S3 ARDUINO  [WIRELM-SMD_ESP32-S3-WROOM-1U]
sheet Sheet_1
BATTERY3  12V 5Ah  [BATTERY-SMD-MY-2032]
C6  470u  [CASE-A_3216]
C7  470u  [CASE-A_3216]
M3  SIM800L  [SIM800LMODULE_SIM800LMODULE]
Q12  IRLZ44  [TO-220-3_L10.0-W4.5-P2.54-T]
Q13  IRF9540  [TO-263-2_L10.0-W9.1-P5.08-LS15.2-BR]
Q14  BC547  [SOT-23-3_L2.9-W1.6-P1.90-LS2.8-TR-CW]
Q15  BC547  [SOT-23-3_L2.9-W1.6-P1.90-LS2.8-TR-CW]
Q16  IRF9540  [TO-263-2_L10.0-W9.1-P5.08-LS15.2-BR]
Q17  BC547  [SOT-23-3_L2.9-W1.6-P1.90-LS2.8-TR-CW]
Q18  IRF9540  [TO-263-2_L10.0-W9.1-P5.08-LS15.2-BR]
R21  22k  [R0603]
R22  10k  [R0603]
R23  1k  [R0603]
R24  1k  [R0603]
R25  10k  [R0603]
R28  1k  [R0603]
R29  10k  [R0603]
R30  133k  [R0603]
R31  1k  [R0603]
R32  1k  [R0603]
R33  10k  [R0603]
S3  BME280  [BME280]
U26  DS3231_module  [DS3231]
U27  ANALOG SENSOR  [ANALOG SENSOR V1]
U28  ESP32-S3 ARDUINO  [WIRELM-SMD_ESP32-S3-WROOM-1U]
U29  MP1584EN  [MP1584EN]
U30  MP1584EN  [MP1584EN]
U31  TL5110  [TSOT-23-6_L2.9-W1.6-P0.95-LS2.8-BR]
U32  MINI360BUCK  [MINI360BUCK]
sheet Sheet_2
BATTERY4  12V 5Ah  [BATTERY-SMD-MY-2032]
C8  470u  [CASE-A_3216]
C9  100u  [CASE-A_3216]
M4  SIM800L  [SIM800LMODULE_SIM800LMODULE]
Q19  IRF9540  [TO-263-2_L10.0-W9.1-P5.08-LS15.2-BR]
Q20  BC547  [SOT-23-3_L2.9-W1.6-P1.90-LS2.8-TR-CW]
Q21  IRF9540  [TO-263-2_L10.0-W9.1-P5.08-LS15.2-BR]
Q22  BC547  [SOT-23-3_L2.9-W1.6-P1.90-LS2.8-TR-CW]
Q23  BC547  [SOT-23-3_L2.9-W1.6-P1.90-LS2.8-TR-CW]
Q24  IRF9540  [TO-263-2_L10.0-W9.1-P5.08-LS15.2-BR]
Q25  IRLZ44  [TO-220-3_L10.0-W4.5-P2.54-T]
R34  10k  [R0603]
R35  1k  [R0603]
R36  1k  [R0603]
R37  133k  [R0603]
R38  10k  [R0603]
R39  1k  [R0603]
R40  10k  [R0603]
R41  1k  [R0603]
R42  1k  [R0603]
R43  10k  [R0603]
R44  22k  [R0603]
S4  BME280  [BME280]
U33  MINI360BUCK  [MINI360BUCK]
U34  TL5110  [TSOT-23-6_L2.9-W1.6-P0.95-LS2.8-BR]
U35  MP1584EN  [MP1584EN]
U36  MP1584EN  [MP1584EN]
U37  Pro micro  [WIRELM-SMD_ESP32-S3-WROOM-1U]
U38  ANALOG SENSOR  [ANALOG SENSOR V1]
U39  DS3231_module  [DS3231]
U40  L  [MPN-TH-20_L28.0-W14.0-P2.54-BL]
sheet Отключаемый делитель
Q4  IRLZ44  [TO-220-3_L10.0-W4.5-P2.54-T]
R5  22k  [R0603]
R6  10k  [R0603]
R7  1k  [R0603]
U5  Arduino ESP32-S3  [WIRELM-SMD_ESP32-S3-WROOM-1U]
sheet Питание по таймеру вар.2
ARDUINO1  GPIO(D7)  [HDR-M-2.54_1X1]
BATTERY1  12V 5Ah  [BATTERY-SMD-MY-2032]
Q5  IRLZ44  [TO-220-3_L10.0-W4.5-P2.54-T]
R8  133k  [R0603]
R9  1k  [R0603]
U6  TL5110  [TSOT-23-6_L2.9-W1.6-P0.95-LS2.8-BR]
U7  MINI360BUCK  [MINI360BUCK]
sheet Питание по таймеру
ARDUINO  GPIO(D7)  [HDR-M-2.54_1X1]
BATTERY  12V 5Ah  [BATTERY-SMD-MY-2032]
C2  1u  [C0603]
C3  1u  [C0603]
Q3  IRLZ44  [TO-220-3_L10.0-W4.5-P2.54-T]
R3  1k  [R0603]
R4  133k  [R0603]
U3  TL5110  [TSOT-23-6_L2.9-W1.6-P0.95-LS2.8-BR]
U4  MCP170  [SOT-89-3_L4.5-W2.4-P1.50-LS4.0-BR]

## Library data of the parts
BATTERY BATTERY1-BATTERY4 BATTERY#2 = MY-2032-10: Contributor: lcsc; Supplier: LCSC; Supplier Part: C964827; Manufacturer: MYOUNG(美阳); JLCPCB Part Class: Extended Part
C1 C4-C9 = C_Tan_SMD_A_EU: Contributor: LCEDA_Lib
M1-M4 = SIM800L MODULE COPY: Contributor: sharad.rask
Q3-Q6 Q11 Q12 Q25 = IRLZ44NPBF: Supplier: LCSC; Manufacturer: Infineon(英飞凌); Supplier Part: C38774; JLCPCB Part Class: Extended Part
Q2 Q7 Q10 Q13 Q16 Q18 Q19 Q21 Q24 = IRF5210: Supplier: LCSC; Manufacturer: IR; Manufacturer Part: IRF5210STRLPBF; image: //image.lceda.cn/szlcsc/C2622.jpg; Supplier Part: C2622; Paste Type: expand; Contributor: LCEDA_Lib
Q1 Q8 Q9 Q14 Q15 Q17 Q20 Q22 Q23 = 2N3906(SOT-23): Supplier: LCSC; Manufacturer: KEC; Manufacturer Part: 2N3906S-RTK/PS; Contributor: LCEDA_Lib; Supplier Part: C147294
R1-R44 = R_0603_US: Contributor: LCEDA_Lib
S1-S4 = BME280
U2 U7 U20 U32 U33 = MINI360BUCK: Contributor: Andrey Fedorov; sourceId: FRLFXR8qI; Manufacturer Part: Mini360; link: http://ali.pub/399f0z
U3 U6 U8 U19 U31 U34 = TPL5110DDCR: Contributor: lcsc; Supplier: LCSC; Supplier Part: C2651358; Manufacturer: TI(德州仪器); JLCPCB Part Class: Extended Part
U9 U10 U17 U18 U29 U30 U35 U36 = MP1584EN: Contributor: babeinlovexd
U1 U5 U11 U16 U28 U37 = ESP32-S3-WROOM-1U: Contributor: lcsc; Supplier: LCSC; Supplier Part: C9900027631; Manufacturer: null; JLCPCB Part Class: Extended Part
U12 U15 U27 U38 = ANALOG SENSOR: Contributor: utbahR
U13 U14 U26 U39 = DS3231_module: Contributor: retret
U21-U24 = mosfet driver D4184: Manufacturer Part: d4184; Contributor: zahiraauliahusniah
U25 U40 = LEVEL CONVERTER 8: Contributor: LCSC; Supplier: LCSC; Supplier Part: C2829587; Manufacturer: null; Manufacturer Part: Level Converter 8; JLCPCB Part Class: Extended Part
ARDUINO ARDUINO1 = HDR-M-2.54_1x1: Supplier Part: C81276; Supplier: LCSC; Contributor: LCEDA_Lib
C2 C3 = C_0603_EU: Contributor: LCEDA_Lib
U4 = MCP1701AT-5002I/MB: Contributor: lcsc; Supplier: LCSC; Supplier Part: C556900; Manufacturer: MICROCHIP(美国微芯); JLCPCB Part Class: Extended Part

## Nets
GND: BATTERY.-(BAT+) BATTERY1.-(BAT+) BATTERY2.-(BAT-) BATTERY3.-(BAT-) BATTERY4.-(BAT-) BATTERY#2.-(BAT-) C1.2 C2.1 C3.1 C4.2 C5.2 C6.2 C7.2 C8.2 C9.2 M1.6(GND) M3.6(GND) M4.6(GND) Q1.1(E) Q3.3(S) Q4.3(S) Q5.3(S) Q6.3(S) Q8.1(E) Q9.1(E) Q11.3(S) Q12.3(S) Q14.1(E) Q15.1(E) Q17.1(E) Q20.1(E) Q22.1(E) Q23.1(E) Q25.3(S) R4.2 R7.2 R8.2 R11.2 R16.2 R23.2 R26.2 R30.1 R37.1 R42.2 S1.2(GND) S2.2(GND) S3.2(GND) S4.2(GND) U1.1(GND) U2.1(IN-) U2.3(OUT-) U3.2(GND) U4.1(GND) U6.2(GND) U7.1(IN-) U7.3(OUT-) U8.2(GND) U12.3(GND) U13.5(GND) U14.5(GND) U19.2(GND) U20.1(IN-) U20.3(OUT-) U21.1(gnd) U21.5(GND) U22.1(gnd) U22.5(GND) U23.1(gnd) U23.5(GND) U24.1(gnd) U24.5(GND) U26.5(GND) U27.3(GND) U28.41(GND) U29.2(GND) U29.4(GND) U30.4(GND) U31.2(GND) U32.1(IN-) U32.3(OUT-) U33.1(IN-) U33.3(OUT-) U34.2(GND) U35.4(GND) U36.2(GND) U36.4(GND) U37.1(GND) U38.3(GND) U39.5(GND) U40.6(GND) U40.15(GND)
VCC: Q2.4(D) R2.1 R5.1
Net-(ARDUINO1-1): ARDUINO1.1 R9.2
Net-(ARDUINO-1): ARDUINO.1 R3.2
Net-(BATTERY1-+): BATTERY1.+(BAT-) U7.2(IN+)
Net-(BATTERY2-+): BATTERY2.+(BAT+) U20.2(IN+) U21.6(Vin) U23.6(Vin)
Net-(BATTERY3-+): BATTERY3.+(BAT+) Q16.4(D) R21.1 R29.1 U30.1(VIN) U32.2(IN+)
Net-(BATTERY4-+): BATTERY4.+(BAT+) Q21.4(D) Q24.4(D) R38.1 R40.1 R44.1 U33.2(IN+) U35.1(VIN)
Net-(BATTERY#2-+): BATTERY#2.+(BAT+) Q10.4(D) R14.1 R18.1 U2.2(IN+)
Net-(BATTERY-+): BATTERY.+(BAT-) C3.2 U4.2(VIN)
Net-(C2-2): C2.2 U3.1(VDD) U4.3(VOUT)
Net-(C4-1): C4.1 M1.2(VCC) Q7.3(S)
Net-(C5-1): C5.1 Q10.3(S) U12.2(VCC)
Net-(C6-1): C6.1 Q13.3(S) U27.2(VCC)
Net-(C7-1): C7.1 Q16.3(S) U29.1(VIN)
Net-(C8-1): C8.1 M4.2(VCC) U36.3(VOUT) U40.5(LV)
Net-(C9-1): C9.1 Q19.3(S) U37.2(3V3) U40.16(HV)
Net-(M1-3): M1.3(RST) U11.38(IO2)
Net-(M1-4): M1.4(RX) U11.37(TXD0)
Net-(M1-5): M1.5(TX) U11.36(RXD0)
Net-(M2-2): M2.2(VCC) U22.8(Vout+) U25.5(LV)
Net-(M2-3): M2.3(RST) U16.38(IO2)
Net-(M2-4): M2.4(RX) U25.10(LV8)
Net-(M2-5): M2.5(TX) U25.9(LV7)
Net-(M2-6): M2.6(GND) U22.7(Vout-) U25.6(GND)
Net-(M3-2): M3.2(VCC) U29.3(VOUT)
Net-(M3-3): M3.3(RST) U28.38(IO2)
Net-(M3-4): M3.4(RX) U28.37(TXD0)
Net-(M3-5): M3.5(TX) U28.36(RXD0)
Net-(M4-3): M4.3(RST) U37.38(IO2)
Net-(M4-4): M4.4(RX) U40.10(LV8)
Net-(M4-5): M4.5(TX) U40.9(LV7)
Net-(Q1-2): Q1.2(B) R1.2
Net-(Q1-3): Q1.3(C) Q2.1(G) R2.2
Net-(Q3-1): Q3.1(G) U3.5(DRV)
Net-(Q4-1): Q4.1(G) R7.1 U5.29(IO36)
Net-(Q4-2): Q4.2(D) R6.2
Net-(Q5-1): Q5.1(G) U6.5(DRV)
Net-(Q6-1): Q6.1(G) U8.5(DRV)
Net-(Q6-2): Q6.2(D) U9.2(GND) U10.2(GND) U11.41(GND)
Net-(Q7-1): Q7.1(G) Q8.3(C) R12.2
Net-(Q7-4): Q7.4(D) R12.1 U10.3(VOUT)
Net-(Q8-2): Q8.2(B) R13.2
Net-(Q9-2): Q9.2(B) R15.2
Net-(Q9-3): Q9.3(C) Q10.1(G) R14.2
Net-(Q11-1): Q11.1(G) R16.1 U11.32(IO39)
Net-(Q11-2): Q11.2(D) R17.2
Net-(Q12-1): Q12.1(G) R23.1 U28.32(IO39)
Net-(Q12-2): Q12.2(D) R22.2
Net-(Q13-1): Q13.1(G) Q14.3(C) R25.2
Net-(Q14-2): Q14.2(B) R24.2
Net-(Q15-2): Q15.2(B) R28.2
Net-(Q15-3): Q15.3(C) Q16.1(G) R29.2
Net-(Q17-2): Q17.2(B) R32.1
Net-(Q17-3): Q17.3(C) Q18.1(G) R33.2
Net-(Q18-3): Q18.3(S) U28.2(3V3)
Net-(Q18-4): Q18.4(D) R33.1 U30.3(VOUT)
Net-(Q19-1): Q19.1(G) Q20.3(C) R34.2
Net-(Q19-4): Q19.4(D) R34.1 U35.3(VOUT)
Net-(Q20-2): Q20.2(B) R35.1
Net-(Q21-1): Q21.1(G) Q22.3(C) R38.2
Net-(Q21-3): Q21.3(S) U36.1(VIN)
Net-(Q22-2): Q22.2(B) R39.2
Net-(Q23-2): Q23.2(B) R41.2
Net-(Q23-3): Q23.3(C) Q24.1(G) R40.2
Net-(Q24-3): Q24.3(S) U38.2(VCC)
Net-(Q25-1): Q25.1(G) R42.1 U37.32(IO39)
Net-(Q25-2): Q25.2(D) R43.2
Net-(R1-1): R1.1 U1.39(IO1)
Net-(R3-1): R3.1 U3.4(DONE)
Net-(R4-1): R4.1 U3.3(DELAY/M_DRV)
Net-(R5-2): R5.2 R6.1 U5.39(IO1)
Net-(R8-1): R8.1 U6.3(DELAY/M_DRV)
Net-(R9-1): R9.1 U6.4(DONE)
Net-(R10-1): R10.1 U8.4(DONE)
Net-(R10-2): R10.2 U11.20(IO12)
Net-(R11-1): R11.1 U8.3(DELAY/M_DRV)
Net-(R13-1): R13.1 U11.39(IO1)
Net-(R15-1): R15.1 U11.35(IO42)
Net-(R17-1): R17.1 R18.2 U11.33(IO40)
Net-(R19-1): R19.1 U23.8(Vout+)
Net-(R19-2): R19.2 R20.1 U16.33(IO40)
Net-(R20-2): R20.2 U23.7(Vout-)
Net-(R21-2): R21.2 R22.1 U28.33(IO40)
Net-(R24-1): R24.1 U28.35(IO42)
Net-(R26-1): R26.1 U19.3(DELAY/M_DRV)
Net-(R27-1): R27.1 U19.4(DONE)
Net-(R27-2): R27.2 U16.20(IO12)
Net-(R28-1): R28.1 U28.39(IO1)
Net-(R30-2): R30.2 U31.3(DELAY/M_DRV)
Net-(R31-1): R31.1 U31.4(DONE)
Net-(R31-2): R31.2 U28.20(IO12)
Net-(R32-2): R32.2 U31.5(DRV)
Net-(R35-2): R35.2 U34.5(DRV)
Net-(R36-1): R36.1 U34.4(DONE)
Net-(R36-2): R36.2 U37.20(IO12)
Net-(R37-2): R37.2 U34.3(DELAY/M_DRV)
Net-(R39-1): R39.1 U37.39(IO1)
Net-(R41-1): R41.1 U37.35(IO42)
Net-(R43-1): R43.1 R44.2 U37.33(IO40)
Net-(S1-1): S1.1(VCC) U9.3(VOUT) U11.2(3V3) U13.1(VCC)
Net-(S1-3): S1.3(SCL) U11.13(IO19) U13.3(SCL)
Net-(S1-4): S1.4(SDA) U11.12(IO8) U13.2(SDA)
Net-(S2-1): S2.1(VCC) U14.1(VCC) U16.2(3V3) U18.3(VOUT) U25.16(HV)
Net-(S2-3): S2.3(SCL) U14.3(SCL) U16.13(IO19)
Net-(S2-4): S2.4(SDA) U14.2(SDA) U16.12(IO8)
Net-(S3-1): S3.1(VCC) U26.1(VCC) U28.8(IO15)
Net-(S3-3): S3.3(SCL) U26.3(SCL) U28.13(IO19)
Net-(S3-4): S3.4(SDA) U26.2(SDA) U28.12(IO8)
Net-(S4-1): S4.1(VCC) U37.8(IO15) U39.1(VCC)
Net-(S4-3): S4.3(SCL) U37.13(IO19) U39.3(SCL)
Net-(S4-4): S4.4(SDA) U37.12(IO8) U39.2(SDA)
Net-(U2-4): U2.4(OUT+) U8.1(VDD)
Net-(U6-1): U6.1(VDD) U7.4(OUT+)
Net-(U11-34): U11.34(IO41) U12.1(A)
Net-(U15-1): U15.1(A) U16.34(IO41)
Net-(U15-2): U15.2(VCC) U24.8(Vout+)
Net-(U15-3): U15.3(GND) U24.7(Vout-)
Net-(U16-32): U16.32(IO39) U23.3(trig)
Net-(U16-35): U16.35(IO42) U24.3(trig)
Net-(U16-36): U16.36(RXD0) U25.11(HV8)
Net-(U16-37): U16.37(TXD0) U25.12(HV7)
Net-(U16-39): U16.39(IO1) U22.3(trig)
Net-(U17-1): U17.1(VIN) U18.1(VIN) U21.8(Vout+) U24.6(Vin)
Net-(U17-2): U17.2(GND) U17.4(GND) U18.2(GND) U18.4(GND) U21.7(Vout-)
Net-(U17-3): U17.3(VOUT) U22.6(Vin)
Net-(U19-1): U19.1(VDD) U20.4(OUT+)
Net-(U19-5): U19.5(DRV) U21.3(trig)
Net-(U27-1): U27.1(A) U28.34(IO41)
Net-(U31-1): U31.1(VDD) U32.4(OUT+)
Net-(U33-4): U33.4(OUT+) U34.1(VDD)
Net-(U37-34): U37.34(IO41) U38.1(A)
Net-(U37-36): U37.36(RXD0) U40.12(HV7)
Net-(U37-37): U37.37(TXD0) U40.11(HV8)

Not connected (* = marked no-connect by the designer): C1 1; M1 1(ANT) 7(SPK-) 8(SPK+) 9(MIC-) 10(MIC+) 11(DTR) 12(RING); M2 1(ANT) 7(SPK-) 8(SPK+) 9(MIC-) 10(MIC+) 11(DTR) 12(RING); M3 1(ANT) 7(SPK-) 8(SPK+) 9(MIC-) 10(MIC+) 11(DTR) 12(RING); M4 1(ANT) 7(SPK-) 8(SPK+) 9(MIC-) 10(MIC+) 11(DTR) 12(RING); Q2 3(S); Q3 2(D); Q5 2(D); Q13 4(D); R25 1; S1 5(CSB) 6(SDD); S2 5(CSB) 6(SDD); S3 5(CSB) 6(SDD); S4 5(CSB) 6(SDD); U1 2(3V3) 3(EN) 4(IO4) 5(IO5) 6(IO6) 7(IO7) 8(IO15) 9(IO16) 10(IO17) 11(IO18) 12(IO8) 13(IO19) 14(IO20) 15(IO3) 16(IO46) 17(IO9) 18(IO10) 19(IO11) 20(IO12) 21(IO13) 22(IO14) 23(IO21) 24(IO47) 25(IO48) 26(IO45) 27(IO0) 28(IO35) 29(IO36) 30(IO37) 31(IO38) 32(IO39) 33(IO40) 34(IO41) 35(IO42) 36(RXD0) 37(TXD0) 38(IO2) 40(GND) 41(GND); U3 6(EN/ONE_SHOT); U5 1(GND) 2(3V3) 3(EN) 4(IO4) 5(IO5) 6(IO6) 7(IO7) 8(IO15) 9(IO16) 10(IO17) 11(IO18) 12(IO8) 13(IO19) 14(IO20) 15(IO3) 16(IO46) 17(IO9) 18(IO10) 19(IO11) 20(IO12) 21(IO13) 22(IO14) 23(IO21) 24(IO47) 25(IO48) 26(IO45) 27(IO0) 28(IO35) 30(IO37) 31(IO38) 32(IO39) 33(IO40) 34(IO41) 35(IO42) 36(RXD0) 37(TXD0) 38(IO2) 40(GND) 41(GND); U6 6(EN/ONE_SHOT); U8 6(EN/ONE_SHOT); U9 1(VIN) 4(GND); U10 1(VIN) 4(GND); U11 1(GND) 3(EN) 4(IO4) 5(IO5) 6(IO6) 7(IO7) 8(IO15) 9(IO16) 10(IO17) 11(IO18) 14(IO20) 15(IO3) 16(IO46) 17(IO9) 18(IO10) 19(IO11) 21(IO13) 22(IO14) 23(IO21) 24(IO47) 25(IO48) 26(IO45) 27(IO0) 28(IO35) 29(IO36) 30(IO37) 31(IO38) 40(GND); U13 4(NC); U14 4(NC); U16 1(GND) 3(EN) 4(IO4) 5(IO5) 6(IO6) 7(IO7) 8(IO15) 9(IO16) 10(IO17) 11(IO18) 14(IO20) 15(IO3) 16(IO46) 17(IO9) 18(IO10) 19(IO11) 21(IO13) 22(IO14) 23(IO21) 24(IO47) 25(IO48) 26(IO45) 27(IO0) 28(IO35) 29(IO36) 30(IO37) 31(IO38) 40(GND) 41(GND); U19 6(EN/ONE_SHOT); U25 1(LV1) 2(LV2) 3(LV3) 4(LV4) 7(LV5) 8(LV6) 13(HV6) 14(HV5) 15(GND) 17(HV4) 18(HV3) 19(HV2) 20(HV1); U26 4(NC); U28 1(GND) 3(EN) 4(IO4) 5(IO5) 6(IO6) 7(IO7) 9(IO16) 10(IO17) 11(IO18) 14(IO20) 15(IO3) 16(IO46) 17(IO9) 18(IO10) 19(IO11) 21(IO13) 22(IO14) 23(IO21) 24(IO47) 25(IO48) 26(IO45) 27(IO0) 28(IO35) 29(IO36) 30(IO37) 31(IO38) 40(GND); U30 2(GND); U31 6(EN/ONE_SHOT); U34 6(EN/ONE_SHOT); U35 2(GND); U37 3(EN) 4(IO4) 5(IO5) 6(IO6) 7(IO7) 9(IO16) 10(IO17) 11(IO18) 14(IO20) 15(IO3) 16(IO46) 17(IO9) 18(IO10) 19(IO11) 21(IO13) 22(IO14) 23(IO21) 24(IO47) 25(IO48) 26(IO45) 27(IO0) 28(IO35) 29(IO36) 30(IO37) 31(IO38) 40(GND) 41(GND); U39 4(NC); U40 1(LV1) 2(LV2) 3(LV3) 4(LV4) 7(LV5) 8(LV6) 13(HV6) 14(HV5) 17(HV4) 18(HV3) 19(HV2) 20(HV1)

## Notes on the sheets
sheet 1
- Battery 12v
  5 Ah
- 12V
- (-)
- (+)
- 4V
- SIM800
- External Sensor
- DC-DC
  12V->4V
- Timer schema
  TPL5110
- ctrl
- ctrl
- DC-DC
  12V->5V
- Power Ctrl Schema
- Power Ctrl Schema
- 5V
- done
- Arduino
  ESP32-S3
- RTC
- BME280
- Voltage measurment
  schema
sheet 2
- (+)
- Pyload
- (-)
- D
- G
- S
sheet 3
- (from DC-DC)
- S
- G
- C
- D
- B
- (+)
- E
- (-)
- Payload
sheet 4
- Battery (+12V)
- D
- G
- S
- Analog input
  (set analog mode)
- Digital Input
- Battery (-)
sheet 5
- (+)
- Pyload
- (-)
- D
- G
- S
sheet 6
- S
- C
- G
- D
- D
- B
- G
- E
- S
- S
- C
- G
- D
- B
- E
- D
- G
- S
sheet 8
- S
- C
- G
- D
- B
- E
- S
- C
- G
- D
- B
- E
- D
- G
- S
sheet 9
- S
- C
- G
- D
- B
- E
- S
- C
- G
- D
- B
- E
- D
- G
- S
